# Altium schematic sheet INV.Main.SCH.SchDoc (part 1 of 2)
size 1549 x 599 mm; SheetNumber: 1; SheetTotal: 1
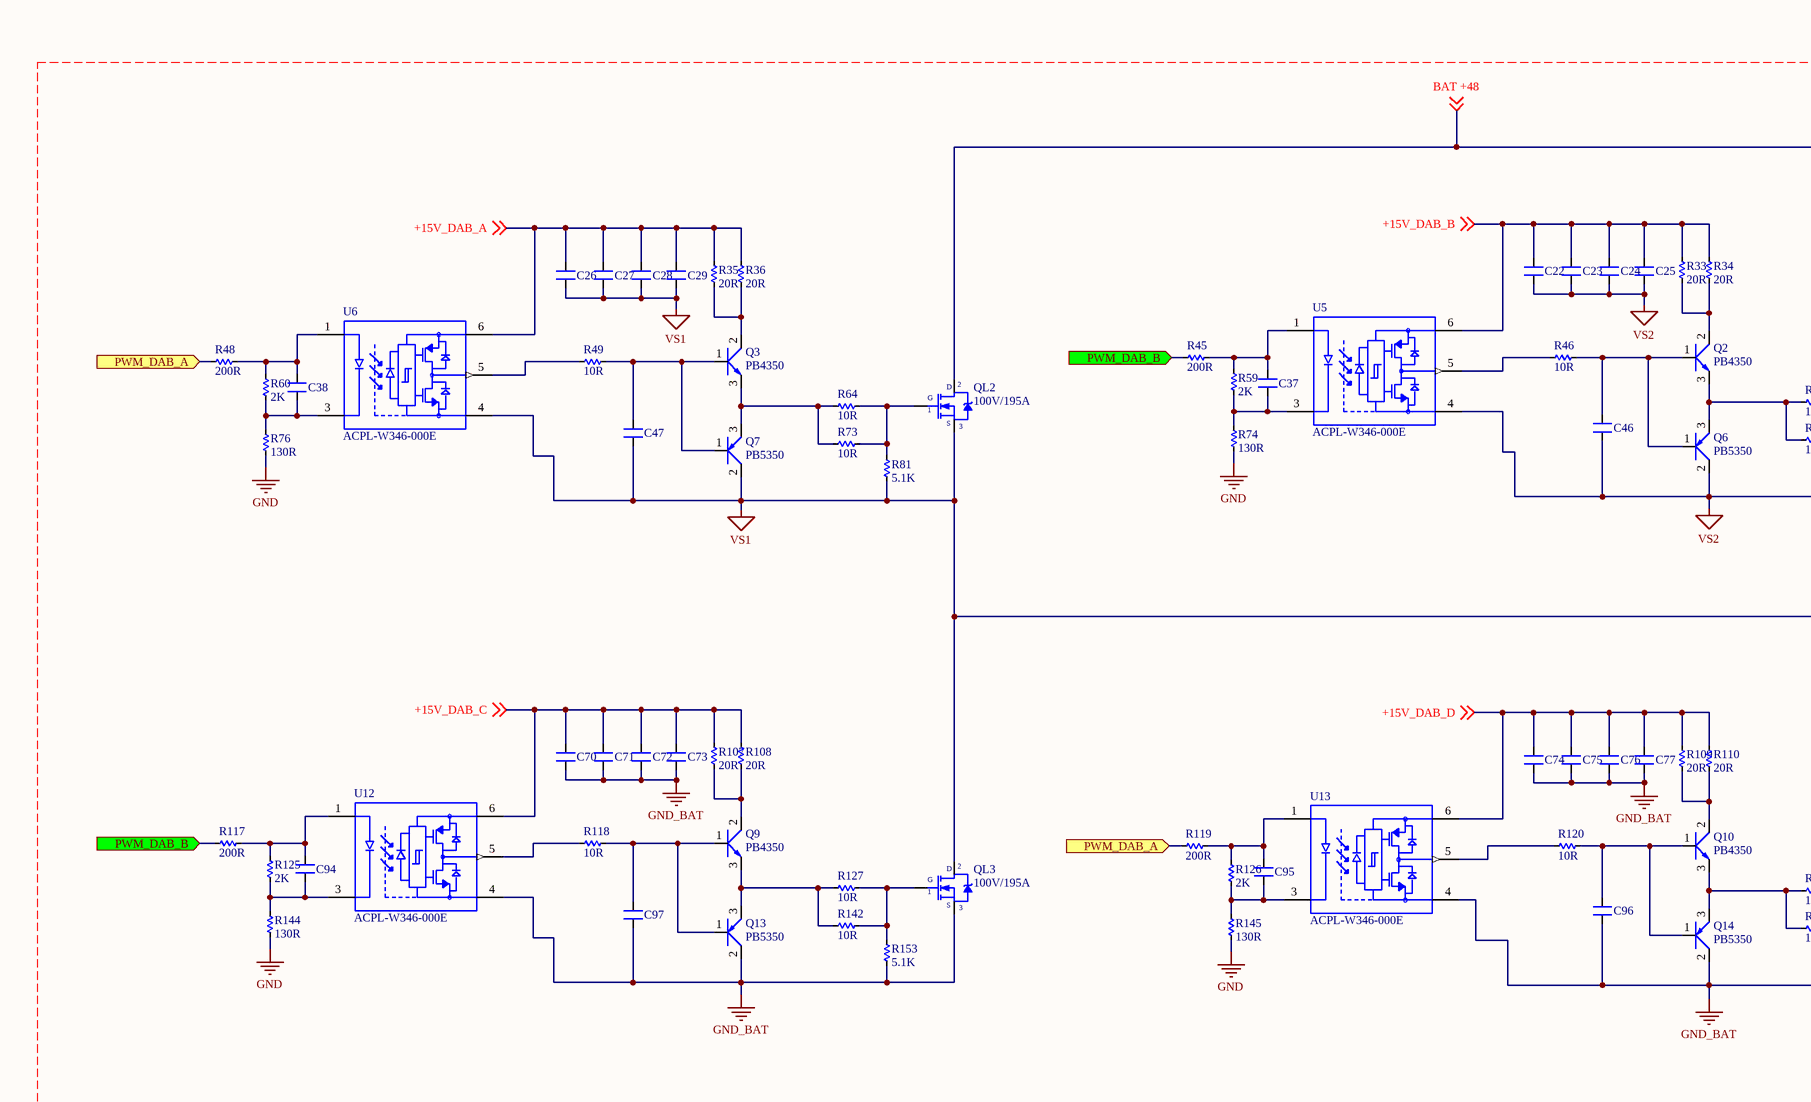
[diagram p0: INV.Main.SCH.SchDoc, top column 1 of 4]
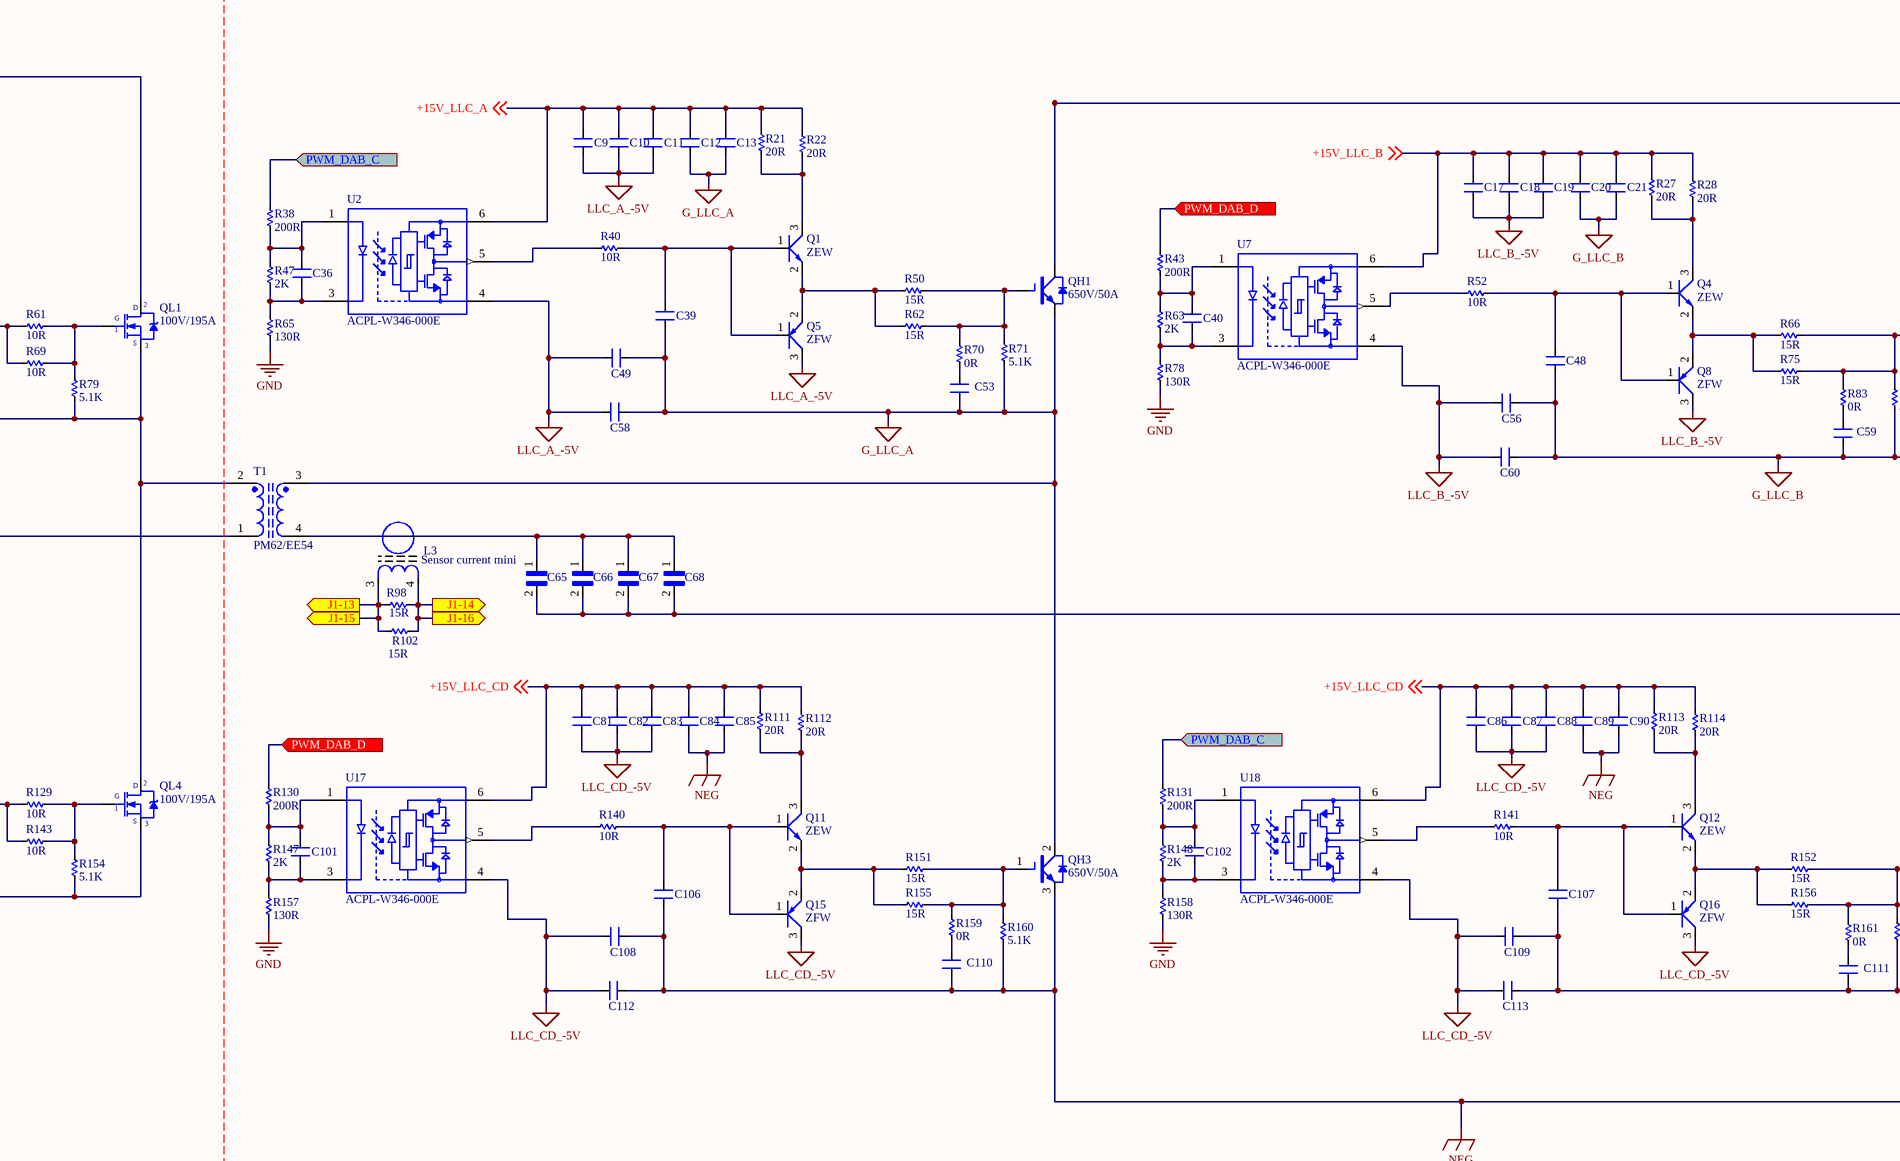
[diagram p1: INV.Main.SCH.SchDoc, top column 2 of 4]
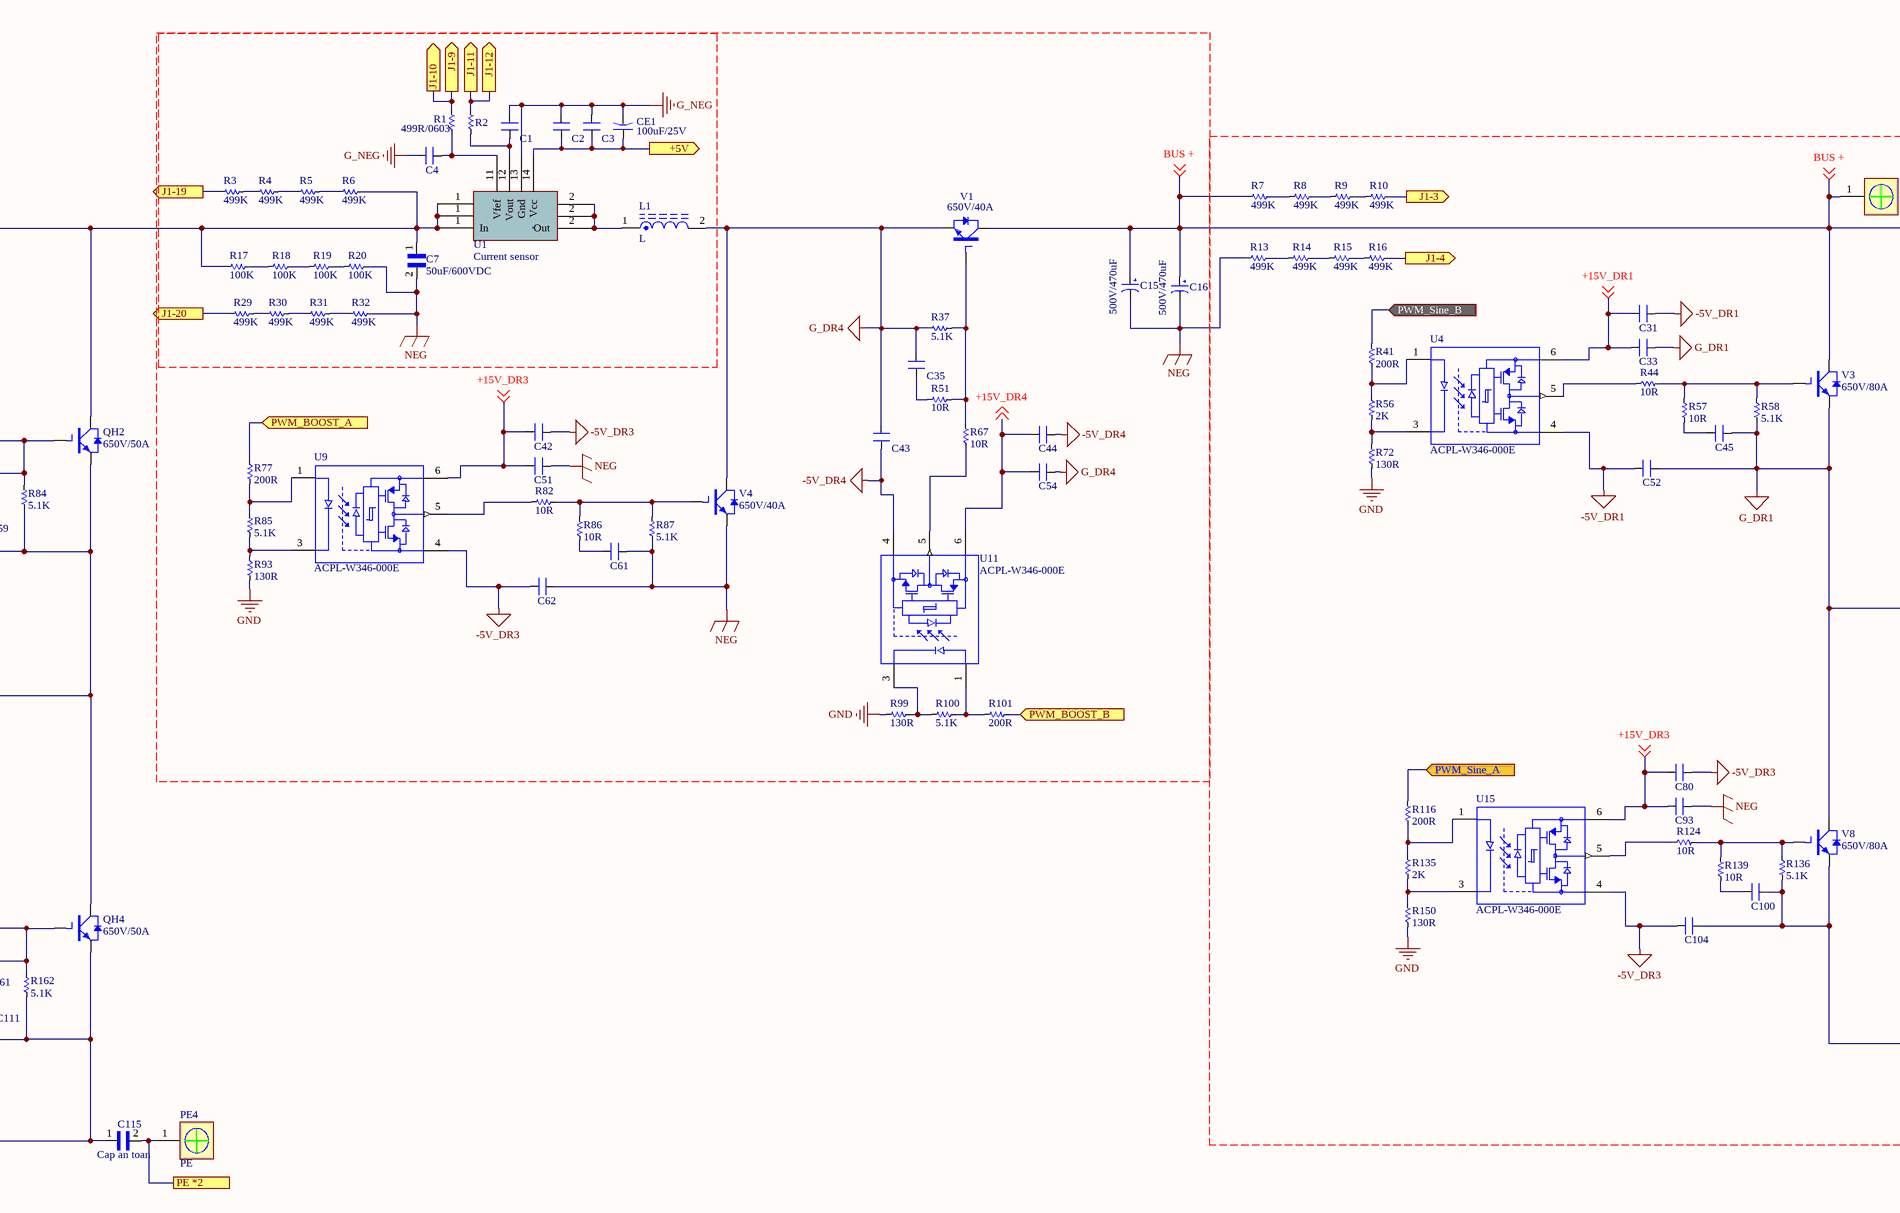
[diagram p2: INV.Main.SCH.SchDoc, top column 3 of 4]
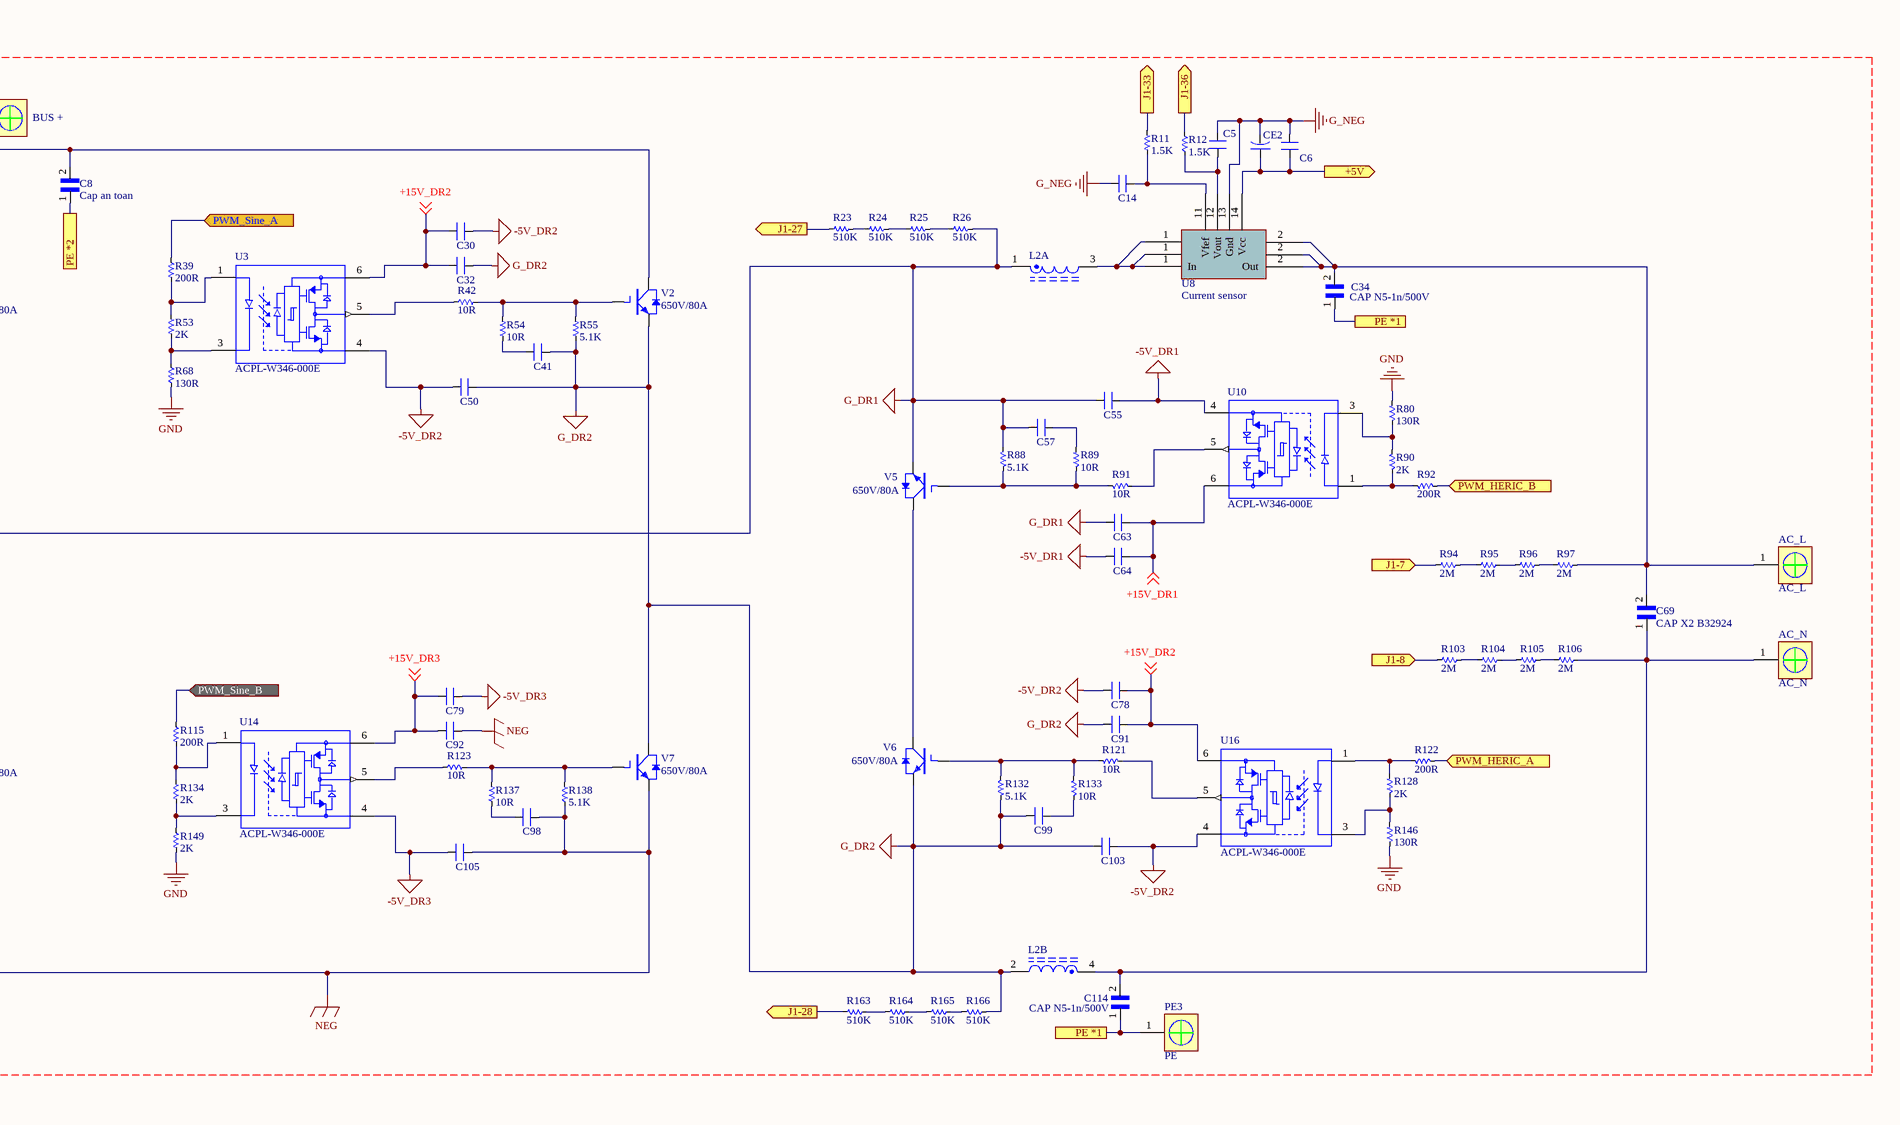
[diagram p3: INV.Main.SCH.SchDoc, top column 4 of 4]
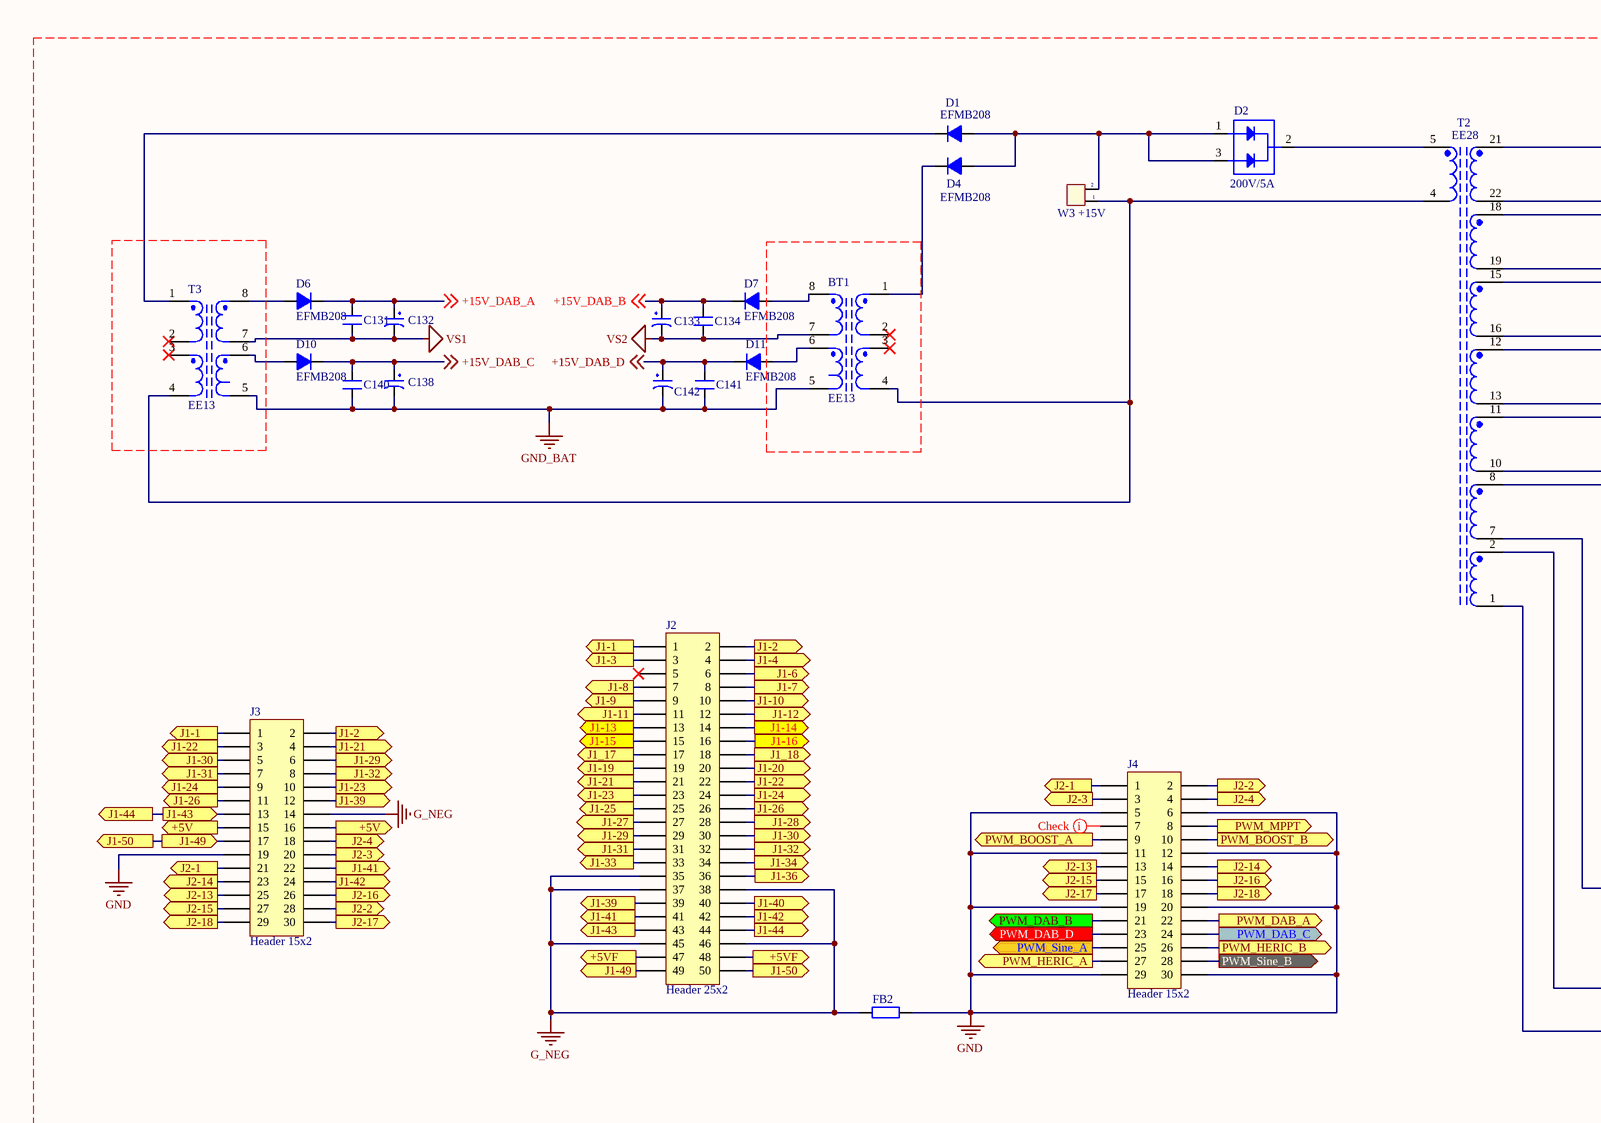
[diagram p4: INV.Main.SCH.SchDoc, bottom column 1 of 4]
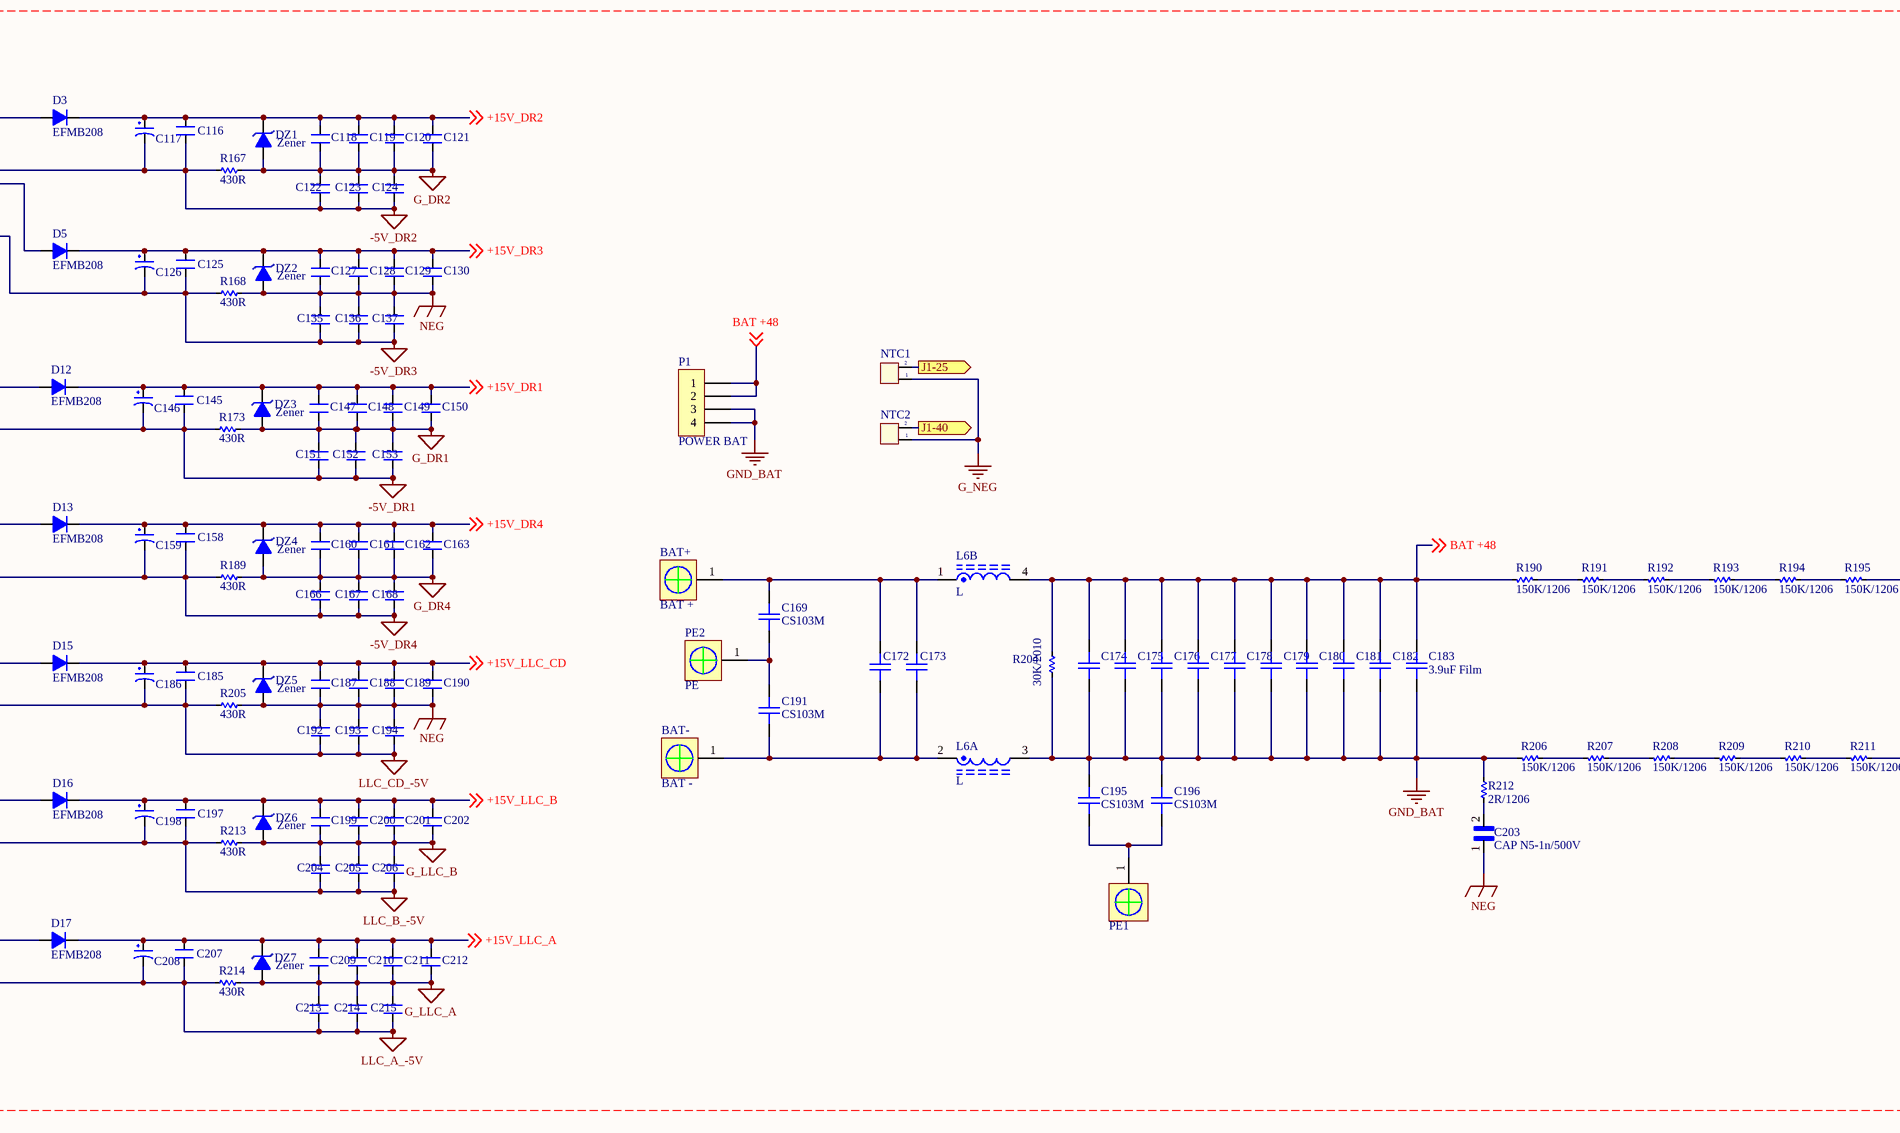
[diagram p5: INV.Main.SCH.SchDoc, bottom column 2 of 4]
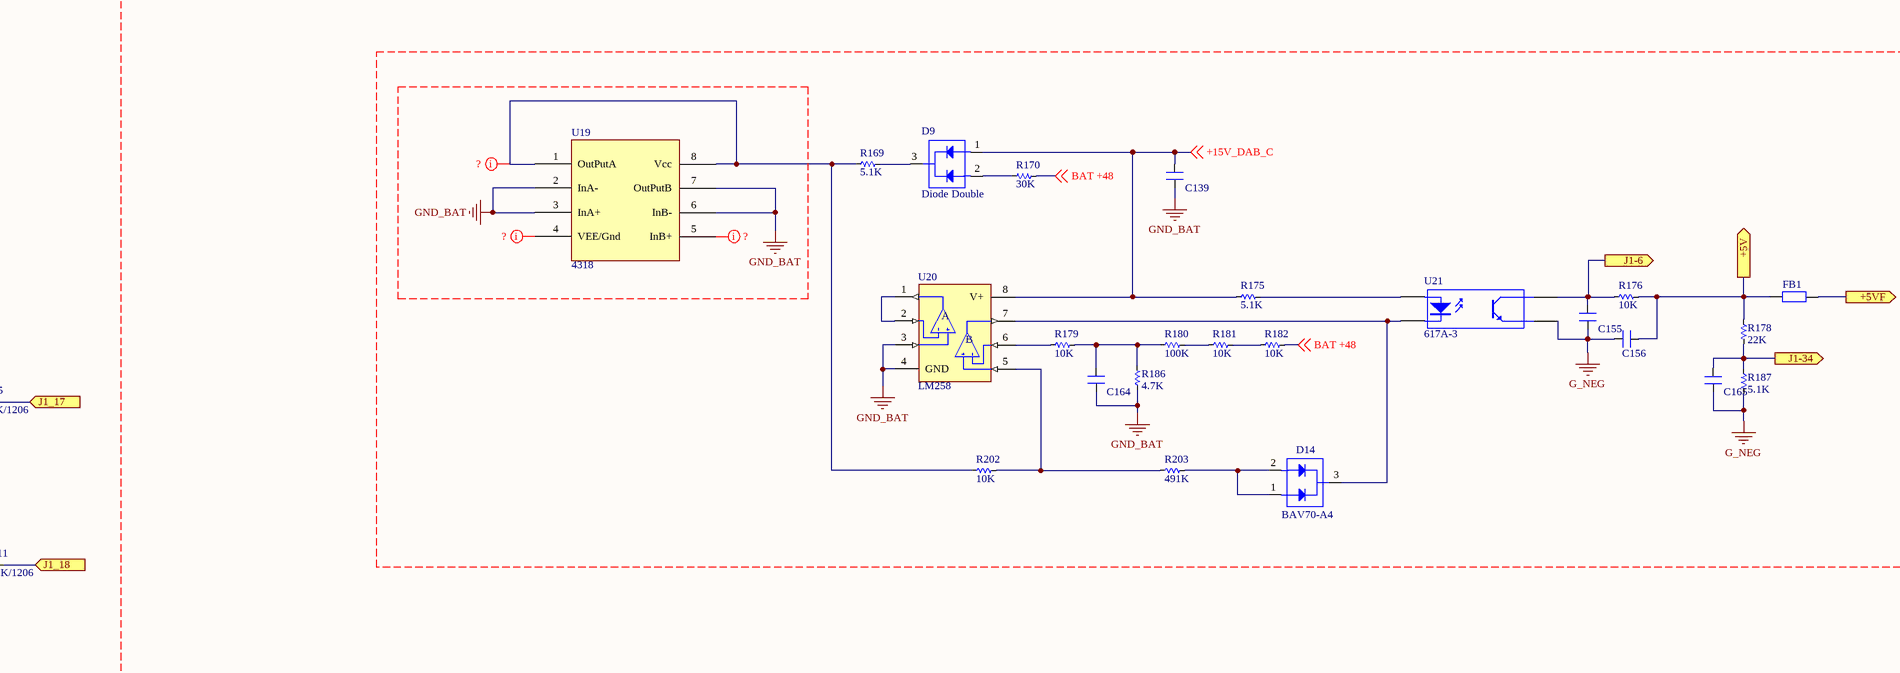
[diagram p6: INV.Main.SCH.SchDoc, bottom column 3 of 4]
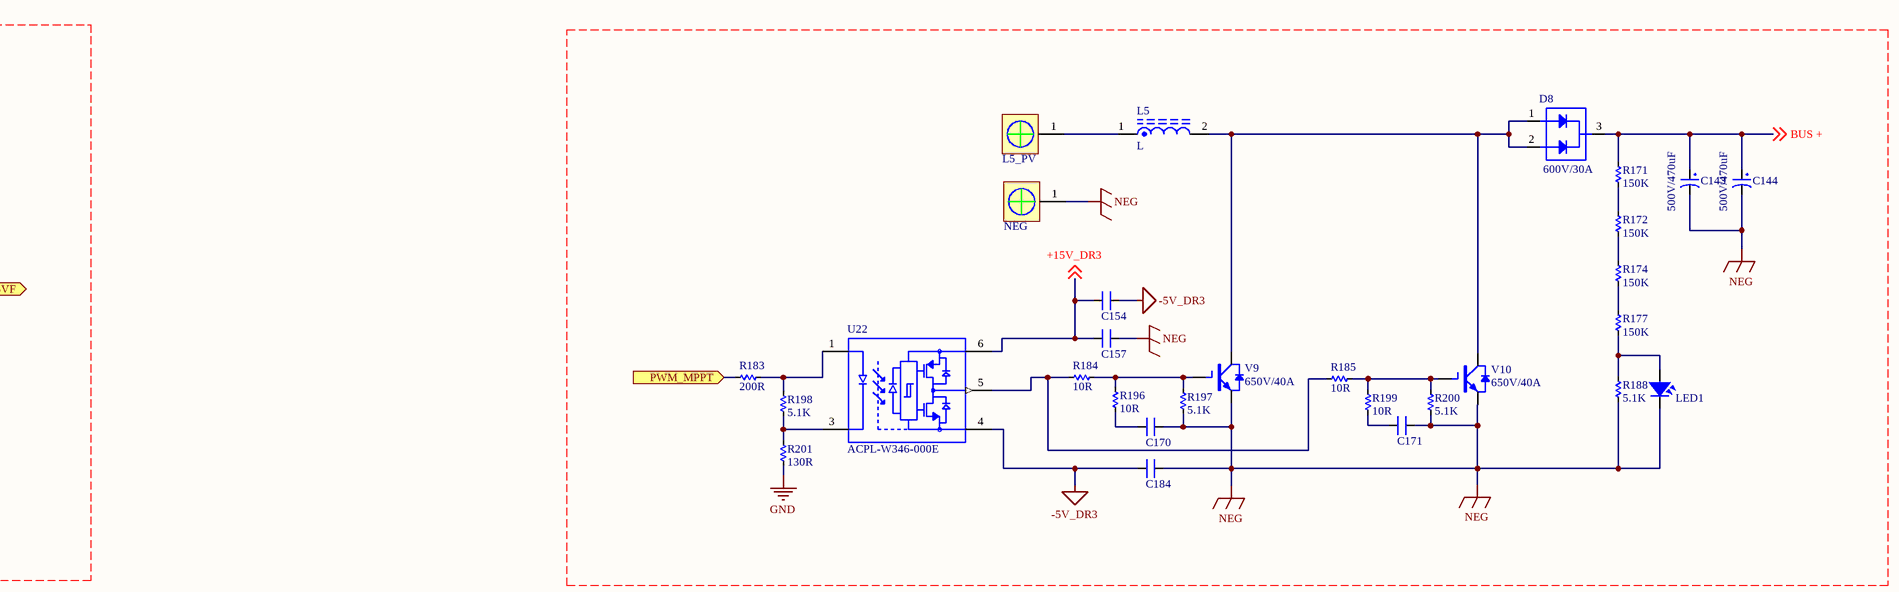
[diagram p7: INV.Main.SCH.SchDoc, bottom column 4 of 4]

## Parts
AC_L  AC_L  [Copper Pipe]
AC_N  AC_N  [Copper Pipe]
BAT+  BAT +  [Copper Pipe]
BAT-  BAT -  [Copper Pipe]
BT1  EE13  [Transformer EE13]
BUS+  BUS +  [Copper Pipe]
C1  0805  [CAP-SMD-0805 EX]  (value not drawn)
C2  0805  [CAP-SMD-0805 EX]  (value not drawn)
C3  0805  [CAP-SMD-0805 EX]  (value not drawn)
C4  0805  [CAP-SMD-0805 EX]  (value not drawn)
C5  0805  [CAP-SMD-0805 EX]  (value not drawn)
C6  0805  [CAP-SMD-0805 EX]  (value not drawn)
C7  50uF/600VDC  [CAP C3D 35x46x35mm]
C8  Cap an toan  [Cap an toan]
C9  0805  [CAP-SMD-0805 EX]  (value not drawn)
C10  0805  [CAP-SMD-0805 EX]  (value not drawn)
C11  0805  [CAP-SMD-0805 EX]  (value not drawn)
C12  0805  [CAP-SMD-0805 EX]  (value not drawn)
C13  0805  [CAP-SMD-0805 EX]  (value not drawn)
C14  0805  [CAP-SMD-0805 EX]  (value not drawn)
C15  500V/470uF  [CAP-35x60mm]
C16  500V/470uF  [CAP-35x60mm]
C17  0805  [CAP-SMD-0805 EX]  (value not drawn)
C18  0805  [CAP-SMD-0805 EX]  (value not drawn)
C19  0805  [CAP-SMD-0805 EX]  (value not drawn)
C20  0805  [CAP-SMD-0805 EX]  (value not drawn)
C21  0805  [CAP-SMD-0805 EX]  (value not drawn)
C22  0805  [CAP-SMD-0805 EX]  (value not drawn)
C23  0805  [CAP-SMD-0805 EX]  (value not drawn)
C24  0805  [CAP-SMD-0805 EX]  (value not drawn)
C25  0805  [CAP-SMD-0805 EX]  (value not drawn)
C26  0805  [CAP-SMD-0805 EX]  (value not drawn)
C27  0805  [CAP-SMD-0805 EX]  (value not drawn)
C28  0805  [CAP-SMD-0805 EX]  (value not drawn)
C29  0805  [CAP-SMD-0805 EX]  (value not drawn)
C30  0805  [CAP-SMD-0805 EX]  (value not drawn)
C31  0805  [CAP-SMD-0805 EX]  (value not drawn)
C32  0805  [CAP-SMD-0805 EX]  (value not drawn)
C33  0805  [CAP-SMD-0805 EX]  (value not drawn)
C34  CAP N5-1n/500V  [CAP 1nF/500VAC, Y1]
C35  0805  [CAP-SMD-0805 EX]  (value not drawn)
C36  0805  [CAP-SMD-0805 EX]  (value not drawn)
C37  0805  [CAP-SMD-0805 EX]  (value not drawn)
C38  0805  [CAP-SMD-0805 EX]  (value not drawn)
C39  0805  [CAP-SMD-0805 EX]  (value not drawn)
C40  0805  [CAP-SMD-0805 EX]  (value not drawn)
C41  0805  [CAP-SMD-0805 EX]  (value not drawn)
C42  0805  [CAP-SMD-0805 EX]  (value not drawn)
C43  0805  [CAP-SMD-0805 EX]  (value not drawn)
C44  0805  [CAP-SMD-0805 EX]  (value not drawn)
C45  0805  [CAP-SMD-0805 EX]  (value not drawn)
C46  0805  [CAP-SMD-0805 EX]  (value not drawn)
C47  0805  [CAP-SMD-0805 EX]  (value not drawn)
C48  0805  [CAP-SMD-0805 EX]  (value not drawn)
C49  0805  [CAP-SMD-0805 EX]  (value not drawn)
C50  0805  [CAP-SMD-0805 EX]  (value not drawn)
C51  0805  [CAP-SMD-0805 EX]  (value not drawn)
C52  0805  [CAP-SMD-0805 EX]  (value not drawn)
C53  Tu dan gom  [CAP-SMD-0805 EX]  (value not drawn)
C54  0805  [CAP-SMD-0805 EX]  (value not drawn)
C55  0805  [CAP-SMD-0805 EX]  (value not drawn)
C56  0805  [CAP-SMD-0805 EX]  (value not drawn)
C57  0805  [CAP-SMD-0805 EX]  (value not drawn)
C58  0805  [CAP-SMD-0805 EX]  (value not drawn)
C59  0805  [CAP-SMD-0805 EX]  (value not drawn)
C60  0805  [CAP-SMD-0805 EX]  (value not drawn)
C61  0805  [CAP-SMD-0805 EX]  (value not drawn)
C62  0805  [CAP-SMD-0805 EX]  (value not drawn)
C63  0805  [CAP-SMD-0805 EX]  (value not drawn)
C64  0805  [CAP-SMD-0805 EX]  (value not drawn)
C65  CBB 150nF/630V  [CAP MMPK82]  (value not drawn)
C66  CBB 150nF/630V  [CAP MMPK82]  (value not drawn)
C67  CBB 150nF/630V  [CAP MMPK82]  (value not drawn)
C68  CBB 150nF/630V  [CAP MMPK82]  (value not drawn)
C69  CAP X2 B32924  [CAP X2 B32924]
C70  0805  [CAP-SMD-0805 EX]  (value not drawn)
C71  0805  [CAP-SMD-0805 EX]  (value not drawn)
C72  0805  [CAP-SMD-0805 EX]  (value not drawn)
C73  0805  [CAP-SMD-0805 EX]  (value not drawn)
C74  0805  [CAP-SMD-0805 EX]  (value not drawn)
C75  0805  [CAP-SMD-0805 EX]  (value not drawn)
C76  0805  [CAP-SMD-0805 EX]  (value not drawn)
C77  0805  [CAP-SMD-0805 EX]  (value not drawn)
C78  0805  [CAP-SMD-0805 EX]  (value not drawn)
C79  0805  [CAP-SMD-0805 EX]  (value not drawn)
C80  0805  [CAP-SMD-0805 EX]  (value not drawn)
C81  0805  [CAP-SMD-0805 EX]  (value not drawn)
C82  0805  [CAP-SMD-0805 EX]  (value not drawn)
C83  0805  [CAP-SMD-0805 EX]  (value not drawn)
C84  0805  [CAP-SMD-0805 EX]  (value not drawn)
C85  0805  [CAP-SMD-0805 EX]  (value not drawn)
C86  0805  [CAP-SMD-0805 EX]  (value not drawn)
C87  0805  [CAP-SMD-0805 EX]  (value not drawn)
C88  0805  [CAP-SMD-0805 EX]  (value not drawn)
C89  0805  [CAP-SMD-0805 EX]  (value not drawn)
C90  0805  [CAP-SMD-0805 EX]  (value not drawn)
C91  0805  [CAP-SMD-0805 EX]  (value not drawn)
C92  0805  [CAP-SMD-0805 EX]  (value not drawn)
C93  0805  [CAP-SMD-0805 EX]  (value not drawn)
C94  0805  [CAP-SMD-0805 EX]  (value not drawn)
C95  0805  [CAP-SMD-0805 EX]  (value not drawn)
C96  0805  [CAP-SMD-0805 EX]  (value not drawn)
C97  0805  [CAP-SMD-0805 EX]  (value not drawn)
C98  0805  [CAP-SMD-0805 EX]  (value not drawn)
C99  0805  [CAP-SMD-0805 EX]  (value not drawn)
C100  0805  [CAP-SMD-0805 EX]  (value not drawn)
C101  0805  [CAP-SMD-0805 EX]  (value not drawn)
C102  0805  [CAP-SMD-0805 EX]  (value not drawn)
C103  0805  [CAP-SMD-0805 EX]  (value not drawn)
C104  0805  [CAP-SMD-0805 EX]  (value not drawn)
C105  0805  [CAP-SMD-0805 EX]  (value not drawn)
C106  0805  [CAP-SMD-0805 EX]  (value not drawn)
C107  0805  [CAP-SMD-0805 EX]  (value not drawn)
C108  0805  [CAP-SMD-0805 EX]  (value not drawn)
C109  0805  [CAP-SMD-0805 EX]  (value not drawn)
C110  Tu dan gom  [CAP-SMD-0805 EX]  (value not drawn)
C111  Tu dan gom  [CAP-SMD-0805 EX]  (value not drawn)
C112  0805  [CAP-SMD-0805 EX]  (value not drawn)
C113  0805  [CAP-SMD-0805 EX]  (value not drawn)
C114  CAP N5-1n/500V  [CAP 1nF/500VAC, Y1]
C115  Cap an toan  [Cap an toan]
C116  Tu dan gom  [CAP-SMD-0805 EX]  (value not drawn)
C117  100uF/25V  [CA-6-P2.5]  (value not drawn)
C118  Tu dan gom  [CAP-SMD-0805 EX]  (value not drawn)
C119  Tu dan gom  [CAP-SMD-0805 EX]  (value not drawn)
C120  Tu dan gom  [CAP-SMD-0805 EX]  (value not drawn)
C121  Tu dan gom  [CAP-SMD-0805 EX]  (value not drawn)
C122  Tu dan gom  [CAP-SMD-0805 EX]  (value not drawn)
C123  Tu dan gom  [CAP-SMD-0805 EX]  (value not drawn)
C124  Tu dan gom  [CAP-SMD-0805 EX]  (value not drawn)
C125  Tu dan gom  [CAP-SMD-0805 EX]  (value not drawn)
C126  100uF/25V  [CA-6-P2.5]  (value not drawn)
C127  Tu dan gom  [CAP-SMD-0805 EX]  (value not drawn)
C128  Tu dan gom  [CAP-SMD-0805 EX]  (value not drawn)
C129  Tu dan gom  [CAP-SMD-0805 EX]  (value not drawn)
C130  Tu dan gom  [CAP-SMD-0805 EX]  (value not drawn)
C131  0805  [CAP-SMD-0805 EX]  (value not drawn)
C132  100uF/25V  [CA-6-P2.5]  (value not drawn)
C133  100uF/25V  [CA-6-P2.5]  (value not drawn)
C134  0805  [CAP-SMD-0805 EX]  (value not drawn)
C135  Tu dan gom  [CAP-SMD-0805 EX]  (value not drawn)
C136  Tu dan gom  [CAP-SMD-0805 EX]  (value not drawn)
C137  Tu dan gom  [CAP-SMD-0805 EX]  (value not drawn)
C138  100uF/25V  [CA-6-P2.5]  (value not drawn)
C139  0805  [CAP-SMD-0805 EX]  (value not drawn)
C140  0805  [CAP-SMD-0805 EX]  (value not drawn)
C141  0805  [CAP-SMD-0805 EX]  (value not drawn)
C142  100uF/25V  [CA-6-P2.5]  (value not drawn)
C143  500V/470uF  [CAP-35x60mm]
C144  500V/470uF  [CAP-35x60mm]
C145  Tu dan gom  [CAP-SMD-0805 EX]  (value not drawn)
C146  100uF/25V  [CA-6-P2.5]  (value not drawn)
C147  Tu dan gom  [CAP-SMD-0805 EX]  (value not drawn)
C148  Tu dan gom  [CAP-SMD-0805 EX]  (value not drawn)
C149  Tu dan gom  [CAP-SMD-0805 EX]  (value not drawn)
C150  Tu dan gom  [CAP-SMD-0805 EX]  (value not drawn)
C151  Tu dan gom  [CAP-SMD-0805 EX]  (value not drawn)
C152  Tu dan gom  [CAP-SMD-0805 EX]  (value not drawn)
C153  Tu dan gom  [CAP-SMD-0805 EX]  (value not drawn)
C154  0805  [CAP-SMD-0805 EX]  (value not drawn)
C155  0805  [CAP-SMD-0805 EX]  (value not drawn)
C156  0805  [CAP-SMD-0805 EX]  (value not drawn)
C157  0805  [CAP-SMD-0805 EX]  (value not drawn)
C158  Tu dan gom  [CAP-SMD-0805 EX]  (value not drawn)
C159  100uF/25V  [CA-6-P2.5]  (value not drawn)
C160  Tu dan gom  [CAP-SMD-0805 EX]  (value not drawn)
C161  Tu dan gom  [CAP-SMD-0805 EX]  (value not drawn)
C162  Tu dan gom  [CAP-SMD-0805 EX]  (value not drawn)
C163  Tu dan gom  [CAP-SMD-0805 EX]  (value not drawn)
C164  0805  [CAP-SMD-0805 EX]  (value not drawn)
C165  0805  [CAP-SMD-0805 EX]  (value not drawn)
C166  Tu dan gom  [CAP-SMD-0805 EX]  (value not drawn)
C167  Tu dan gom  [CAP-SMD-0805 EX]  (value not drawn)
C168  Tu dan gom  [CAP-SMD-0805 EX]  (value not drawn)
C169  CS103M  [Cap an toan CS103M]
C170  0805  [CAP-SMD-0805 EX]  (value not drawn)
C171  0805  [CAP-SMD-0805 EX]  (value not drawn)
C172  (no value)  [CAP-SMD-1206 EX]
C173  (no value)  [CAP-SMD-1206 EX]
C174  3.9uF Film  [Cap Film CL21]  (value not drawn)
C175  395K  [Cap Film CL21]  (value not drawn)
C176  395K  [Cap Film CL21]  (value not drawn)
C177  395K  [Cap Film CL21]  (value not drawn)
C178  395K  [Cap Film CL21]  (value not drawn)
C179  395K  [Cap Film CL21]  (value not drawn)
C180  395K  [Cap Film CL21]  (value not drawn)
C181  395K  [Cap Film CL21]  (value not drawn)
C182  395K  [Cap Film CL21]  (value not drawn)
C183  3.9uF Film  [Cap Film CL21]
C184  0805  [CAP-SMD-0805 EX]  (value not drawn)
C185  Tu dan gom  [CAP-SMD-0805 EX]  (value not drawn)
C186  100uF/25V  [CA-6-P2.5]  (value not drawn)
C187  Tu dan gom  [CAP-SMD-0805 EX]  (value not drawn)
C188  Tu dan gom  [CAP-SMD-0805 EX]  (value not drawn)
C189  Tu dan gom  [CAP-SMD-0805 EX]  (value not drawn)
C190  Tu dan gom  [CAP-SMD-0805 EX]  (value not drawn)
C191  CS103M  [Cap an toan CS103M]
C192  Tu dan gom  [CAP-SMD-0805 EX]  (value not drawn)
C193  Tu dan gom  [CAP-SMD-0805 EX]  (value not drawn)
C194  Tu dan gom  [CAP-SMD-0805 EX]  (value not drawn)
C195  CS103M  [Cap an toan CS103M]
C196  CS103M  [Cap an toan CS103M]
C197  Tu dan gom  [CAP-SMD-0805 EX]  (value not drawn)
C198  100uF/25V  [CA-6-P2.5]  (value not drawn)
C199  Tu dan gom  [CAP-SMD-0805 EX]  (value not drawn)
C200  Tu dan gom  [CAP-SMD-0805 EX]  (value not drawn)
C201  Tu dan gom  [CAP-SMD-0805 EX]  (value not drawn)
C202  Tu dan gom  [CAP-SMD-0805 EX]  (value not drawn)
C203  CAP N5-1n/500V  [CAP 1nF/500VAC, Y1]
C204  Tu dan gom  [CAP-SMD-0805 EX]  (value not drawn)
C205  Tu dan gom  [CAP-SMD-0805 EX]  (value not drawn)
C206  Tu dan gom  [CAP-SMD-0805 EX]  (value not drawn)
C207  Tu dan gom  [CAP-SMD-0805 EX]  (value not drawn)
C208  100uF/25V  [CA-6-P2.5]  (value not drawn)
C209  Tu dan gom  [CAP-SMD-0805 EX]  (value not drawn)
C210  Tu dan gom  [CAP-SMD-0805 EX]  (value not drawn)
C211  Tu dan gom  [CAP-SMD-0805 EX]  (value not drawn)
C212  Tu dan gom  [CAP-SMD-0805 EX]  (value not drawn)
C213  Tu dan gom  [CAP-SMD-0805 EX]  (value not drawn)
C214  Tu dan gom  [CAP-SMD-0805 EX]  (value not drawn)
C215  Tu dan gom  [CAP-SMD-0805 EX]  (value not drawn)
CE1  100uF/25V  [CA-6-P2.5]
CE2  100uF/25V  [CA-6-P2.5]  (value not drawn)
D1  EFMB208  [SMB]
D2  200V/5A  [TO252-123]
D3  EFMB208  [SMB]
D4  EFMB208  [SMB]
D5  EFMB208  [SMB]
D6  EFMB208  [SMB]
D7  EFMB208  [SMB]
D8  600V/30A  [TO-247-Diode]
D9  Diode Double  [SOT-23]
D10  EFMB208  [SMB]
D11  EFMB208  [SMB]
D12  EFMB208  [SMB]
D13  EFMB208  [SMB]
D14  BAV70-A4  [SOT-23]
D15  EFMB208  [SMB]
D16  EFMB208  [SMB]
D17  EFMB208  [SMB]
DZ1  Zener  [SMA]
DZ2  Zener  [SMA]
DZ3  Zener  [SMA]
DZ4  Zener  [SMA]
DZ5  Zener  [SMA]
DZ6  Zener  [SMA]
DZ7  Zener  [SMA]
FB1  (no value)  [RES-SMD-1206 EX]
FB2  (no value)  [RES-SMD-1206 EX]
J1  W3 +15V  [Header2]
J2  Header 25x2  [Header 2x50]
J3  Header 15x2  [Header 2x15]
J4  Header 15x2  [Header 2x15]
L1  L  [LBOSHOG-V1]
L2  (no value)  [LSINEOG-V1]  (parts A,B of 2)
L3  Sensor current mini  [Current sensor Mini]
L5  L  [LBOSPVOG-V1]
L5_PV  L5_PV  [Copper Pipe]
L6  L  [LBATOG-V1]  (parts A,B of 2)
LED1  LED  [LED-0805-Red]  (value not drawn)
NEG  NEG  [Copper Pipe]
NTC1  Temp Sensor  [JP 1x2 CT]  (value not drawn)
NTC2  Temp Sensor  [JP 1x2 CT]  (value not drawn)
P1  POWER BAT  [XH2.54M-4]
PE1  PE  [Copper Pipe]  (value not drawn)
PE2  PE  [Copper Pipe]
PE3  PE  [Copper Pipe]
PE4  PE  [Copper Pipe]
Q1  ZEW  [SOT-23]
Q2  PB4350  [SOT-2230P700X175-4N]
Q3  PB4350  [SOT-2230P700X175-4N]
Q4  ZEW  [SOT-23]
Q5  ZFW  [SOT-23]
Q6  PB5350  [SOT-2230P700X175-4N]
Q7  PB5350  [SOT-2230P700X175-4N]
Q8  ZFW  [SOT-23]
Q9  PB4350  [SOT-2230P700X175-4N]
Q10  PB4350  [SOT-2230P700X175-4N]
Q11  ZEW  [SOT-23]
Q12  ZEW  [SOT-23]
Q13  PB5350  [SOT-2230P700X175-4N]
Q14  PB5350  [SOT-2230P700X175-4N]
Q15  ZFW  [SOT-23]
Q16  ZFW  [SOT-23]
QH1  650V/50A  [TO-247_1]
QH2  650V/50A  [TO-247_1]
QH3  650V/50A  [TO-247_1]
QH4  650V/50A  [TO-247_1]
QL1  100V/195A  [TO-247]
QL2  100V/195A  [TO-247]
QL3  100V/195A  [TO-247]
QL4  100V/195A  [TO-247]
R1  499R/0603  [RES-SMD-1206 EX]
R2  499R/0603  [RES-SMD-1206 EX]  (value not drawn)
R3  499K  [RES-SMD-1206 EX]
R4  499K  [RES-SMD-1206 EX]
R5  499K  [RES-SMD-1206 EX]
R6  499K  [RES-SMD-1206 EX]
R7  499K  [RES-SMD-1206 EX]
R8  499K  [RES-SMD-1206 EX]
R9  499K  [RES-SMD-1206 EX]
R10  499K  [RES-SMD-1206 EX]
R11  1.5K  [RES-SMD-0805 EX]
R12  1.5K  [RES-SMD-0805 EX]
R13  499K  [RES-SMD-1206 EX]
R14  499K  [RES-SMD-1206 EX]
R15  499K  [RES-SMD-1206 EX]
R16  499K  [RES-SMD-1206 EX]
R17  100K  [RES-SMD-1206 EX]
R18  100K  [RES-SMD-1206 EX]
R19  100K  [RES-SMD-1206 EX]
R20  100K  [RES-SMD-1206 EX]
R21  20R  [RES-SMD-1206 EX]
R22  20R  [RES-SMD-1206 EX]
R23  510K  [RES-SMD-1206 EX]
R24  510K  [RES-SMD-1206 EX]
R25  510K  [RES-SMD-1206 EX]
R26  510K  [RES-SMD-1206 EX]
R27  20R  [RES-SMD-1206 EX]
R28  20R  [RES-SMD-1206 EX]
R29  499K  [RES-SMD-1206 EX]
R30  499K  [RES-SMD-1206 EX]
R31  499K  [RES-SMD-1206 EX]
R32  499K  [RES-SMD-1206 EX]
R33  20R  [RES-SMD-1206 EX]
R34  20R  [RES-SMD-1206 EX]
R35  20R  [RES-SMD-1206 EX]
R36  20R  [RES-SMD-1206 EX]
R37  5.1K  [RES-SMD-0805 EX]
R38  200R  [RES-SMD-0805 EX]
R39  200R  [RES-SMD-0805 EX]
R40  10R  [RES-SMD-1206 EX]
R41  200R  [RES-SMD-0805 EX]
R42  10R  [RES-SMD-1206 EX]
R43  200R  [RES-SMD-0805 EX]
R44  10R  [RES-SMD-1206 EX]
R45  200R  [RES-SMD-0805 EX]
R46  10R  [RES-SMD-1206 EX]
R47  2K  [RES-SMD-0805 EX]
R48  200R  [RES-SMD-0805 EX]
R49  10R  [RES-SMD-1206 EX]
R50  15R  [RES-SMD-1206 EX]
R51  10R  [RES-SMD-0805 EX]
R52  10R  [RES-SMD-1206 EX]
R53  2K  [RES-SMD-0805 EX]
R54  10R  [RES-SMD-0805 EX]
R55  5.1K  [RES-SMD-0805 EX]
R56  2K  [RES-SMD-0805 EX]
R57  10R  [RES-SMD-0805 EX]
R58  5.1K  [RES-SMD-0805 EX]
R59  2K  [RES-SMD-0805 EX]
R60  2K  [RES-SMD-0805 EX]
R61  10R  [RES-SMD-1206 EX]
R62  15R  [RES-SMD-1206 EX]
R63  2K  [RES-SMD-0805 EX]
R64  10R  [RES-SMD-1206 EX]
R65  130R  [RES-SMD-0805 EX]
R66  15R  [RES-SMD-1206 EX]
R67  10R  [RES-SMD-1206 EX]
R68  130R  [RES-SMD-0805 EX]
R69  10R  [RES-SMD-1206 EX]
R70  0R  [RES-SMD-0805 EX]
R71  5.1K  [RES-SMD-0805 EX]
R72  130R  [RES-SMD-0805 EX]
R73  10R  [RES-SMD-1206 EX]
R74  130R  [RES-SMD-0805 EX]
R75  15R  [RES-SMD-1206 EX]
R76  130R  [RES-SMD-0805 EX]
R77  200R  [RES-SMD-0805 EX]
R78  130R  [RES-SMD-0805 EX]
R79  5.1K  [RES-SMD-0805 EX]
R80  130R  [RES-SMD-0805 EX]
R81  5.1K  [RES-SMD-0805 EX]
R82  10R  [RES-SMD-1206 EX]
R83  0R  [RES-SMD-0805 EX]
R84  5.1K  [RES-SMD-0805 EX]
R85  5.1K  [RES-SMD-0805 EX]
R86  10R  [RES-SMD-0805 EX]
R87  5.1K  [RES-SMD-0805 EX]
R88  5.1K  [RES-SMD-0805 EX]
R89  10R  [RES-SMD-0805 EX]
R90  2K  [RES-SMD-0805 EX]
R91  10R  [RES-SMD-1206 EX]
R92  200R  [RES-SMD-0805 EX]
R93  130R  [RES-SMD-0805 EX]
R94  2M  [RES-SMD-1206 EX]
R95  2M  [RES-SMD-1206 EX]
R96  2M  [RES-SMD-1206 EX]
R97  2M  [RES-SMD-1206 EX]
R98  15R  [RES-SMD-1206 EX]
R99  130R  [RES-SMD-0805 EX]
R100  5.1K  [RES-SMD-0805 EX]
R101  200R  [RES-SMD-0805 EX]
R102  15R  [RES-SMD-1206 EX]
R103  2M  [RES-SMD-1206 EX]
R104  2M  [RES-SMD-1206 EX]
R105  2M  [RES-SMD-1206 EX]
R106  2M  [RES-SMD-1206 EX]
R107  20R  [RES-SMD-1206 EX]
R108  20R  [RES-SMD-1206 EX]
R109  20R  [RES-SMD-1206 EX]
R110  20R  [RES-SMD-1206 EX]
R111  20R  [RES-SMD-1206 EX]
R112  20R  [RES-SMD-1206 EX]
R113  20R  [RES-SMD-1206 EX]
R114  20R  [RES-SMD-1206 EX]
R115  200R  [RES-SMD-0805 EX]
R116  200R  [RES-SMD-0805 EX]
R117  200R  [RES-SMD-0805 EX]
R118  10R  [RES-SMD-1206 EX]
R119  200R  [RES-SMD-0805 EX]
R120  10R  [RES-SMD-1206 EX]
R121  10R  [RES-SMD-1206 EX]
R122  200R  [RES-SMD-0805 EX]
R123  10R  [RES-SMD-1206 EX]
R124  10R  [RES-SMD-1206 EX]
R125  2K  [RES-SMD-0805 EX]
R126  2K  [RES-SMD-0805 EX]
R127  10R  [RES-SMD-1206 EX]
R128  2K  [RES-SMD-0805 EX]
R129  10R  [RES-SMD-1206 EX]
R130  200R  [RES-SMD-0805 EX]
R131  200R  [RES-SMD-0805 EX]
R132  5.1K  [RES-SMD-0805 EX]
R133  10R  [RES-SMD-0805 EX]
R134  2K  [RES-SMD-0805 EX]
R135  2K  [RES-SMD-0805 EX]
R136  5.1K  [RES-SMD-0805 EX]
R137  10R  [RES-SMD-0805 EX]
R138  5.1K  [RES-SMD-0805 EX]
R139  10R  [RES-SMD-0805 EX]
R140  10R  [RES-SMD-1206 EX]
R141  10R  [RES-SMD-1206 EX]
R142  10R  [RES-SMD-1206 EX]
R143  10R  [RES-SMD-1206 EX]
R144  130R  [RES-SMD-0805 EX]
R145  130R  [RES-SMD-0805 EX]
R146  130R  [RES-SMD-0805 EX]
R147  2K  [RES-SMD-0805 EX]
R148  2K  [RES-SMD-0805 EX]
R149  2K  [RES-SMD-0805 EX]
R150  130R  [RES-SMD-0805 EX]
R151  15R  [RES-SMD-1206 EX]
R152  15R  [RES-SMD-1206 EX]
R153  5.1K  [RES-SMD-0805 EX]
R154  5.1K  [RES-SMD-0805 EX]
R155  15R  [RES-SMD-1206 EX]
R156  15R  [RES-SMD-1206 EX]
R157  130R  [RES-SMD-0805 EX]
R158  130R  [RES-SMD-0805 EX]
R159  0R  [RES-SMD-0805 EX]
R160  5.1K  [RES-SMD-0805 EX]
R161  0R  [RES-SMD-0805 EX]
R162  5.1K  [RES-SMD-0805 EX]
R163  510K  [RES-SMD-1206 EX]
R164  510K  [RES-SMD-1206 EX]
R165  510K  [RES-SMD-1206 EX]
R166  510K  [RES-SMD-1206 EX]
R167  430R  [RES-SMD-1210 EX]
R168  430R  [RES-SMD-1210 EX]
R169  5.1K  [RES-SMD-0805 EX]
R170  30K  [RES-SMD-1210 EX]
R171  150K  [RES-SMD-1210 EX]
R172  150K  [RES-SMD-1210 EX]
R173  430R  [RES-SMD-1210 EX]
R174  150K  [RES-SMD-1210 EX]
R175  5.1K  [RES-SMD-0805 EX]
R176  10K  [RES-SMD-0805 EX]
R177  150K  [RES-SMD-1210 EX]
R178  22K  [RES-SMD-0805 EX]
R179  10K  [RES-SMD-0805 EX]
R180  100K  [RES-SMD-1206 EX]
R181  10K  [RES-SMD-0805 EX]
R182  10K  [RES-SMD-0805 EX]
R183  200R  [RES-SMD-0805 EX]
R184  10R  [RES-SMD-1206 EX]
R185  10R  [RES-SMD-1206 EX]
R186  4.7K  [RES-SMD-0805 EX]
R187  5.1K  [RES-SMD-0805 EX]
R188  5.1K  [RES-SMD-0805]
R189  430R  [RES-SMD-1210 EX]
R190  150K/1206  [RES-SMD-1206 EX]
R191  150K/1206  [RES-SMD-1206 EX]
R192  150K/1206  [RES-SMD-1206 EX]
R193  150K/1206  [RES-SMD-1206 EX]
R194  150K/1206  [RES-SMD-1206 EX]
R195  150K/1206  [RES-SMD-1206 EX]
R196  10R  [RES-SMD-0805 EX]
R197  5.1K  [RES-SMD-0805 EX]
R198  5.1K  [RES-SMD-0805 EX]
R199  10R  [RES-SMD-0805 EX]
R200  5.1K  [RES-SMD-0805 EX]
R201  130R  [RES-SMD-0805 EX]
R202  10K  [RES-SMD-0805 EX]
R203  491K  [RES-SMD-0805 EX]
R204  30K/2010  [RES-SMD-1210 EX]
R205  430R  [RES-SMD-1210 EX]
R206  150K/1206  [RES-SMD-1206 EX]
R207  150K/1206  [RES-SMD-1206 EX]
R208  150K/1206  [RES-SMD-1206 EX]
R209  150K/1206  [RES-SMD-1206 EX]
R210  150K/1206  [RES-SMD-1206 EX]
R211  150K/1206  [RES-SMD-1206 EX]
R212  2R/1206  [RES-SMD-1206 EX]
R213  430R  [RES-SMD-1210 EX]
R214  430R  [RES-SMD-1210 EX]
T1  PM62/EE54  [Transformer PM62]
T2  EE28  [Transformer EE28]
T3  EE13  [Transformer EE13]
U1  Current sensor  [Current sensor STB-CAS]
U2  ACPL-W346-000E  [SOIC127P1150X360-6N]
U3  ACPL-W346-000E  [SOIC127P1150X360-6N]
U4  ACPL-W346-000E  [SOIC127P1150X360-6N]
U5  ACPL-W346-000E  [SOIC127P1150X360-6N]
U6  ACPL-W346-000E  [SOIC127P1150X360-6N]
U7  ACPL-W346-000E  [SOIC127P1150X360-6N]
U8  Current sensor  [Current sensor STB-CAS]
U9  ACPL-W346-000E  [SOIC127P1150X360-6N]
U10  ACPL-W346-000E  [SOIC127P1150X360-6N]
U11  ACPL-W346-000E  [SOIC127P1150X360-6N]
U12  ACPL-W346-000E  [SOIC127P1150X360-6N]
U13  ACPL-W346-000E  [SOIC127P1150X360-6N]
U14  ACPL-W346-000E  [SOIC127P1150X360-6N]
U15  ACPL-W346-000E  [SOIC127P1150X360-6N]
U16  ACPL-W346-000E  [SOIC127P1150X360-6N]
U17  ACPL-W346-000E  [SOIC127P1150X360-6N]
U18  ACPL-W346-000E  [SOIC127P1150X360-6N]
U19  4318  [SOP 8]
U20  LM258  [SOIC127P600X175-8N]
U21  617A-3  [SOP4]
U22  ACPL-W346-000E  [SOIC127P1150X360-6N]
V1  650V/40A  [TO-247_1]
V2  650V/80A  [TO-247_1]
V3  650V/80A  [TO-247_1]
V4  650V/40A  [TO-247_1]
V5  650V/80A  [TO-247_1]
V6  650V/80A  [TO-247_1]
V7  650V/80A  [TO-247_1]
V8  650V/80A  [TO-247_1]
V9  650V/40A  [TO-247_1]
V10  650V/40A  [TO-247_1]

## Ports
+5V (out, see INV.Main.SCH[1D], INV.Main.SCH[3A], INV.Main.SCH[3D]), +5V (out, see INV.Main.SCH[1D], INV.Main.SCH[3A], INV.Main.SCH[3D], INV.Main.SCH[4A]), +5V (out, see INV.Main.SCH[1D], INV.Main.SCH[3A], INV.Main.SCH[4A]), +5V (out, see INV.Main.SCH[1D], INV.Main.SCH[3D], INV.Main.SCH[4A]), +5VF (out, see INV.Main.SCH[1D]), +5VF (out, see INV.Main.SCH[1D], INV.Main.SCH[3D]), J1-1 (out, see INV.Main.SCH[1D]), J1-2 (out, see INV.Main.SCH[1D]), J1-3 (out, see INV.Main.SCH[1D]), J1-3 (out, see INV.Main.SCH[3A]), J1-4 (out, see INV.Main.SCH[1D]), J1-4 (out, see INV.Main.SCH[3A]), J1-6 (out, see INV.Main.SCH[1D]), J1-6 (out, see INV.Main.SCH[3C]), J1-7 (in, see INV.Main.SCH[1D]), J1-7 (out, see INV.Main.SCH[4B]), J1-8 (in, see INV.Main.SCH[1D]), J1-8 (out, see INV.Main.SCH[4B]), J1-9 (out, see INV.Main.SCH[1D]), J1-9 (out, see INV.Main.SCH[3A]), J1-10 (out, see INV.Main.SCH[1D]), J1-10 (out, see INV.Main.SCH[3A]), J1-11 (out, see INV.Main.SCH[1D]), J1-11 (out, see INV.Main.SCH[3A]), J1-12 (out, see INV.Main.SCH[1D]), J1-12 (out, see INV.Main.SCH[3A]), J1-13 (out, see INV.Main.SCH[1D]), J1-13 (out, see INV.Main.SCH[2B]), J1-14 (out, see INV.Main.SCH[1D]), J1-14 (out, see INV.Main.SCH[2B]), J1-15 (out, see INV.Main.SCH[1D]), J1-15 (out, see INV.Main.SCH[2B]), J1-16 (out, see INV.Main.SCH[1D]), J1-16 (out, see INV.Main.SCH[2B]), J1-19 (out, see INV.Main.SCH[1D]), J1-19 (out, see INV.Main.SCH[2A]), J1-20 (out, see INV.Main.SCH[1D]), J1-20 (out, see INV.Main.SCH[2B]), J1-21 (out, see INV.Main.SCH[1D]), J1-22 (out, see INV.Main.SCH[1D]), J1-23 (out, see INV.Main.SCH[1D]), J1-24 (out, see INV.Main.SCH[1D]), J1-25 (out, see INV.Main.SCH[1D]), J1-25 (out, see INV.Main.SCH[2C]), J1-26 (out, see INV.Main.SCH[1D]), J1-27 (out, see INV.Main.SCH[1D]), J1-27 (out, see INV.Main.SCH[4B]), J1-28 (out, see INV.Main.SCH[1D]), J1-28 (out, see INV.Main.SCH[4C]), J1-29 (out, see INV.Main.SCH[1D]), J1-30 (out, see INV.Main.SCH[1D]), J1-31 (out, see INV.Main.SCH[1D]), J1-32 (out, see INV.Main.SCH[1D]), J1-33 (out, see INV.Main.SCH[1D]), J1-33 (out, see INV.Main.SCH[4A]), J1-34 (out, see INV.Main.SCH[1D]), J1-34 (out, see INV.Main.SCH[3D]), J1-36 (out, see INV.Main.SCH[1D]), J1-36 (out, see INV.Main.SCH[4A]), J1-39 (out, see INV.Main.SCH[1D]), J1-40 (out, see INV.Main.SCH[1D]), J1-40 (out, see INV.Main.SCH[2C]), J1-41 (out, see INV.Main.SCH[1D]), J1-42 (out, see INV.Main.SCH[1D]), J1-43 (out, see INV.Main.SCH[1D]), J1-44 (out, see INV.Main.SCH[1D]), J1-49 (out, see INV.Main.SCH[1D]), J1-50 (out, see INV.Main.SCH[1D]), J1_17 (in, see INV.Main.SCH[1D]), J1_17 (out, see INV.Main.SCH[2D]), J1_18 (in, see INV.Main.SCH[1D]), J1_18 (out, see INV.Main.SCH[2D]), J2-1 (out, see INV.Main.SCH[1D]), J2-2 (out, see INV.Main.SCH[1D]), J2-3 (out, see INV.Main.SCH[1D]), J2-4 (out, see INV.Main.SCH[1D]), J2-13 (out, see INV.Main.SCH[1D]), J2-14 (out, see INV.Main.SCH[1D]), J2-15 (out, see INV.Main.SCH[1D]), J2-16 (out, see INV.Main.SCH[1D]), J2-17 (out, see INV.Main.SCH[1D]), J2-18 (out, see INV.Main.SCH[1D]), PE *1 (see INV.Main.SCH[4B]), PE *1 (see INV.Main.SCH[4C]), PE *2 (see INV.Main.SCH[2C]), PE *2 (see INV.Main.SCH[3B]), PWM_BOOST_A (in, see INV.Main.SCH[1D]), PWM_BOOST_A (out, see INV.Main.SCH[2B]), PWM_BOOST_B (in, see INV.Main.SCH[1D]), PWM_BOOST_B (out, see INV.Main.SCH[3B]), PWM_DAB_A (in, see INV.Main.SCH[1B], INV.Main.SCH[1D]), PWM_DAB_A (out, see INV.Main.SCH[1B]), PWM_DAB_B (in, see INV.Main.SCH[1B], INV.Main.SCH[1D]), PWM_DAB_B (out, see INV.Main.SCH[1B]), PWM_DAB_C (in, see INV.Main.SCH[1D], INV.Main.SCH[2B]), PWM_DAB_C (out, see INV.Main.SCH[2B]), PWM_DAB_D (in, see INV.Main.SCH[1D], INV.Main.SCH[2B]), PWM_DAB_D (out, see INV.Main.SCH[2B]), PWM_HERIC_A (in, see INV.Main.SCH[1D]), PWM_HERIC_A (out, see INV.Main.SCH[4B]), PWM_HERIC_B (in, see INV.Main.SCH[1D]), PWM_HERIC_B (out, see INV.Main.SCH[4B]), PWM_MPPT (in, see INV.Main.SCH[1D]), PWM_MPPT (out, see INV.Main.SCH[4D]), PWM_Sine_A (in, see INV.Main.SCH[1D], INV.Main.SCH[3B]), PWM_Sine_A (out, see INV.Main.SCH[3B]), PWM_Sine_B (in, see INV.Main.SCH[1D], INV.Main.SCH[3B]), PWM_Sine_B (out, see INV.Main.SCH[3B])

## Nets
-5V_DR1: C31.1 C52.2 C55.1 C64.2 C145.2 C146.2 C151.1 C152.1 C153.1 R173.2 T2.16 U4.4(VEE) U10.4(VEE)
-5V_DR2: C30.1 C50.2 C78.2 C103.1 C116.2 C117.2 C122.1 C123.1 C124.1 R167.2 T2.22 U3.4(VEE) U16.4(VEE)
-5V_DR3: C42.2 C62.1 C79.1 C80.1 C104.2 C105.2 C125.2 C126.2 C135.1 C136.1 C137.1 C154.1 C184.2 R168.2 T2.19 U9.4(VEE) U14.4(VEE) U15.4(VEE) U22.4(VEE)
-5V_DR4: C43.1 C44.1 C158.2 C159.2 C166.1 C167.1 C168.1 R189.2 T2.13 U11.4(VEE)
G_DR1: C33.1 C45.1 C52.1 C55.2 C57.2 C63.2 C147.2 C148.2 C149.2 C150.2 C151.2 C152.2 C153.2 DZ3.1(A) L2.1 R26.2 R58.2 R88.2 R173.1 V3.3(E) V5.3(E) V8.2(C)
G_DR2: C32.1 C41.1 C50.1 C91.2 C99.2 C103.2 C118.2 C119.2 C120.2 C121.2 C122.2 C123.2 C124.2 DZ1.1(A) L2.2 R55.2 R132.1 R166.2 R167.1 V2.3(E) V6.3(E) V7.2(C)
G_DR4: C35.2 C43.2 C54.1 C160.2 C161.2 C162.2 C163.2 C166.2 C167.2 C168.2 DZ4.1(A) L1.2 R37.1 R189.1 V1.3(E) V4.2(C)
G_LLC_A: C12.1 C13.1 C39.1 C49.1 C53.2 C58.1 C209.2 C210.2 C211.2 C212.2 C213.2 C214.2 C215.2 DZ7.1(A) QH1.3(E) QH3.2(C) R71.2 R214.1 T1.3
G_LLC_B: C20.1 C21.1 C48.1 C56.1 C59.2 C60.1 C65.2 C66.2 C67.2 C68.2 C199.2 C200.2 C201.2 C202.2 C204.2 C205.2 C206.2 DZ6.1(A) QH2.3(E) QH4.2(C) R84.2 R213.1
G_NEG: C1.1 C2.1 C3.1 C4.2 C5.1 C6.1 C14.2 C155.2 C156.1 C165.1 CE1.2 CE2.2 FB2.2 J2.35 J2.37 J2.38 J2.45 J2.46 J3.14 NTC1.1 NTC2.1 R187.2 U1.13(Gnd) U8.13(Gnd) U21.3
GND: FB2.1 J3.19 J4.5 J4.6 J4.11 J4.12 J4.19 J4.20 J4.29 J4.30 R65.2 R68.1 R72.1 R74.2 R76.2 R78.2 R80.1 R93.2 R99.1 R144.2 R145.2 R146.2 R149.1 R150.1 R157.2 R158.2 R201.2
GND_BAT: BT1.5 C70.1 C71.1 C72.1 C73.1 C74.1 C75.1 C76.1 C77.1 C96.1 C97.1 C138.2 C139.2 C140.1 C141.1 C142.2 C164.2 C174.1 C175.1 C176.1 C177.1 C178.1 C179.1 C180.1 C181.1 C182.1 C183.1 C195.2 C196.2 L6.3 P1.3 P1.4 Q13.2(C) Q14.2(C) QL3.3(S) QL4.3(S) R153.2 R154.2 R186.1 R204.2 R206.2 R212.2 T3.5 U12.4(VEE) U13.4(VEE) U19.2(InA-) U19.3(InA+) U19.6(InB-) U19.7(OutPutB) U20.3(+INA) U20.4(GND)
LLC_A_-5V: C9.1 C10.1 C11.1 C49.2 C58.2 C207.2 C208.2 C213.1 C214.1 C215.1 Q5.3(C) R214.2 T2.1 U2.4(VEE)
LLC_B_-5V: C17.1 C18.1 C19.1 C56.2 C60.2 C197.2 C198.2 C204.1 C205.1 C206.1 Q8.3(C) R213.2 T2.7 U7.4(VEE)
LLC_CD_-5V: C81.1 C82.1 C83.1 C86.1 C87.1 C88.1 C108.2 C109.2 C112.2 C113.2 C185.2 C186.2 C192.1 C193.1 C194.1 Q15.3(C) Q16.3(C) R205.2 T2.10 U17.4(VEE) U18.4(VEE)
NEG: C7.2 C15.2 C16.2 C51.2 C61.2 C62.2 C84.1 C85.1 C89.1 C90.1 C92.1 C93.1 C98.1 C100.1 C104.1 C105.1 C106.1 C107.1 C108.1 C109.1 C110.2 C111.2 C112.1 C113.1 C115.1 C127.2 C128.2 C129.2 C130.2 C135.2 C136.2 C137.2 C143.2 C144.2 C157.1 C170.1 C171.1 C184.1 C187.2 C188.2 C189.2 C190.2 C192.2 C193.2 C194.2 C203.1 DZ2.1(A) DZ5.1(A) LED1.2 NEG.1 QH3.3(E) QH4.3(E) R13.1 R20.2 R32.2 R87.2 R136.2 R138.1 R160.2 R162.2 R168.1 R188.2 R197.2 R200.2 R205.1 V4.3(E) V7.3(E) V8.3(E) V9.3(E) V10.3(E)
VS1: C26.1 C27.1 C28.1 C29.1 C47.1 C131.1 C132.2 Q7.2(C) QL2.3(S) QL3.2(D) R81.2 T1.1 T3.7 U6.4(VEE)
VS2: BT1.7 C22.1 C23.1 C24.1 C25.1 C46.1 C133.2 C134.1 Q6.2(C) QL1.3(S) QL4.2(D) R79.2 T1.2 U5.4(VEE)
+5V: C2.2 C3.2 C6.2 C156.2 CE1.1 CE2.1 FB1.1 J3.15 J3.16 R176.1 R178.2 U1.14(Vcc) U8.14(Vcc) ; port +5V
+5VF: FB1.2 J2.47 J2.48 ; port +5VF
+15V_DAB_A: C26.2 C27.2 C28.2 C29.2 C131.2 C132.1 D6.2(K) R35.1 R36.1 U6.6(VCC) ; off-sheet +15V_DAB_A
+15V_DAB_B: C22.2 C23.2 C24.2 C25.2 C133.1 C134.2 D7.2(K) R33.1 R34.1 U5.6(VCC) ; off-sheet +15V_DAB_B
+15V_DAB_C: C70.2 C71.2 C72.2 C73.2 C138.1 C139.1 C140.2 D9.1(A1) D10.2(K) R107.1 R108.1 R175.2 U12.6(VCC) U20.8(V+) ; off-sheet +15V_DAB_C
+15V_DAB_D: C74.2 C75.2 C76.2 C77.2 C141.2 C142.1 D11.2(K) R109.1 R110.1 U13.6(VCC) ; off-sheet +15V_DAB_D
+15V_DR1: C31.2 C33.2 C63.1 C64.1 C145.1 C146.1 C147.1 C148.1 C149.1 C150.1 D12.2(K) DZ3.2(K) U4.6(VCC) U10.6(VCC) ; off-sheet +15V_DR1
+15V_DR2: C30.2 C32.2 C78.1 C91.1 C116.1 C117.1 C118.1 C119.1 C120.1 C121.1 D3.2(K) DZ1.2(K) U3.6(VCC) U16.6(VCC) ; off-sheet +15V_DR2
+15V_DR3: C42.1 C51.1 C79.2 C80.2 C92.2 C93.2 C125.1 C126.1 C127.1 C128.1 C129.1 C130.1 C154.2 C157.2 D5.2(K) DZ2.2(K) U9.6(VCC) U14.6(VCC) U15.6(VCC) U22.6(VCC) ; off-sheet +15V_DR3
+15V_DR4: C44.2 C54.2 C158.1 C159.1 C160.1 C161.1 C162.1 C163.1 D13.2(K) DZ4.2(K) U11.6(VCC) ; off-sheet +15V_DR4
+15V_LLC_A: C9.2 C10.2 C11.2 C12.2 C13.2 C207.1 C208.1 C209.1 C210.1 C211.1 C212.1 D17.2(K) DZ7.2(K) R21.1 R22.1 U2.6(VCC) ; off-sheet +15V_LLC_A
+15V_LLC_B: C17.2 C18.2 C19.2 C20.2 C21.2 C197.1 C198.1 C199.1 C200.1 C201.1 C202.1 D16.2(K) DZ6.2(K) R27.1 R28.1 U7.6(VCC) ; off-sheet +15V_LLC_B
+15V_LLC_CD: C81.2 C82.2 C83.2 C84.2 C85.2 C86.2 C87.2 C88.2 C89.2 C90.2 C185.1 C186.1 C187.1 C188.1 C189.1 C190.1 D15.2(K) DZ5.2(K) R111.1 R112.1 R113.1 R114.1 U17.6(VCC) U18.6(VCC) ; off-sheet +15V_LLC_CD
BAT +48: C174.2 C175.2 C176.2 C177.2 C178.2 C179.2 C180.2 C181.2 C182.2 C183.2 L6.4 P1.1 P1.2 QL1.2(D) QL2.2(D) R170.2 R182.1 R190.2 R204.1 ; off-sheet BAT +48
BUS +: BUS+.1 C8.2 C15.1 C16.1 C143.1 C144.1 D8.3(K) R7.1 R171.1 V1.2(C) V2.2(C) V3.2(C) ; off-sheet BUS +
J1-1: J2.1 J3.1 ; port J1-1
J1-2: J2.2 J3.2 ; port J1-2
J1-3: J2.3 R10.2 ; port J1-3
J1-4: J2.4 R16.2 ; port J1-4
J1-6: C155.1 J2.6 R176.2 U21.4 ; port J1-6
J1-7: J2.8 R94.1 ; port J1-7
J1-8: J2.7 R103.1 ; port J1-8
J1-10: J2.9 J2.10 R1.2 ; port J1-9, port J1-10
J1-11: J2.11 J2.12 R2.2 ; port J1-11, port J1-12
J1-13: J2.13 J2.15 L3.3 R98.1 R102.1 ; port J1-13, port J1-15
J1-14: J2.14 J2.16 L3.4 R98.2 R102.2 ; port J1-14, port J1-16
J1-19: J2.19 R3.1 ; port J1-19
J1-20: J2.20 R29.1 ; port J1-20
J1-21: J2.21 J3.4 ; port J1-21
J1-22: J2.22 J3.3 ; port J1-22
J1-23: J2.23 J3.10 ; port J1-23
J1-24: J2.24 J3.9 ; port J1-24
J1-25: J2.25 NTC1.2 ; port J1-25
J1-26: J2.26 J3.11 ; port J1-26
J1-27: J2.27 R23.1 ; port J1-27
J1-28: J2.28 R163.1 ; port J1-28
J1-29: J2.29 J3.6 ; port J1-29
J1-30: J2.30 J3.5 ; port J1-30
J1-31: J2.31 J3.7 ; port J1-31
J1-32: J2.32 J3.8 ; port J1-32
J1-33: J2.33 R11.2 ; port J1-33
J1-34: C165.2 J2.34 R178.1 R187.1 ; port J1-34
J1-36: J2.36 R12.2 ; port J1-36
J1-39: J2.39 J3.12 ; port J1-39
J1-40: J2.40 NTC2.2 ; port J1-40
J1-41: J2.41 J3.22 ; port J1-41
J1-42: J2.42 J3.24 ; port J1-42
J1-43: J2.43 J2.44 J3.13 ; port J1-43, port J1-44
J1-49: J2.49 J2.50 J3.17 ; port J1-49, port J1-50
J1_17: J2.17 R195.1 ; port J1_17
J1_18: J2.18 R211.1 ; port J1_18
J2-1: J3.21 J4.1 ; port J2-1
J2-2: J3.28 J4.2 ; port J2-2
J2-3: J3.20 J4.3 ; port J2-3
J2-4: J3.18 J4.4 ; port J2-4
J2-13: J3.25 J4.13 ; port J2-13
J2-14: J3.23 J4.14 ; port J2-14
J2-15: J3.27 J4.15 ; port J2-15
J2-16: J3.26 J4.16 ; port J2-16
J2-17: J3.30 J4.17 ; port J2-17
J2-18: J3.29 J4.18 ; port J2-18
PE *1: C34.1 C114.1 PE3.1 ; port PE *1
PE *2: C8.1 C115.2 PE4.1 ; port PE *2
PWM_BOOST_A: J4.9 R77.1 ; port PWM_BOOST_A
PWM_BOOST_B: J4.10 R101.2 ; port PWM_BOOST_B
PWM_DAB_A: J4.22 R48.2 R119.2 ; port PWM_DAB_A
PWM_DAB_B: J4.21 R45.2 R117.2 ; port PWM_DAB_B
PWM_DAB_C: J4.24 R38.1 R131.1 ; port PWM_DAB_C
PWM_DAB_D: J4.23 R43.1 R130.1 ; port PWM_DAB_D
PWM_HERIC_A: J4.27 R122.1 ; port PWM_HERIC_A
PWM_HERIC_B: J4.26 R92.1 ; port PWM_HERIC_B
PWM_MPPT: J4.8 R183.1 ; port PWM_MPPT
PWM_Sine_A: J4.25 R39.2 R116.2 ; port PWM_Sine_A
PWM_Sine_B: J4.28 R41.2 R115.2 ; port PWM_Sine_B
NetAC_L_1: AC_L.1 C34.2 C69.2 R97.2 U8.2(Out)
NetAC_N_1: AC_N.1 C69.1 C114.2 L2.4 R106.2
NetBAT+_1: BAT+.1 C169.2 C172.2 C173.2 L6.1
NetBAT-_1: BAT-.1 C172.1 C173.1 C191.1 L6.2
NetBT1_1: BT1.1 D4.2(K)
NetBT1_4: BT1.4 J1.1 T2.4 T3.4
NetBT1_6: BT1.6 D11.1(A)
NetBT1_8: BT1.8 D7.1(A)
NetC1_2: C1.2 R2.1 U1.12(Vout)
NetC4_1: C4.1 R1.1 U1.11(Vfef)
NetC5_2: C5.2 R12.1 U8.12(Vout)
NetC7_1: C7.1 QH1.2(C) QH2.2(C) R6.2 R17.1 U1.1(In)
NetC14_1: C14.1 R11.1 U8.11(Vfef)
NetC35_1: C35.1 R51.1
NetC36_1: C36.1 R47.2 R65.1 U2.3(CATHODE)
NetC36_2: C36.2 R38.2 R47.1 U2.1(ANODE)
NetC37_1: C37.1 R59.2 R74.1 U5.3(CATHODE)
NetC37_2: C37.2 R45.1 R59.1 U5.1(ANODE)
NetC38_1: C38.1 R60.2 R76.1 U6.3(CATHODE)
NetC38_2: C38.2 R48.1 R60.1 U6.1(ANODE)
NetC39_2: C39.2 Q1.1(B) Q5.1(B) R40.2
NetC40_1: C40.1 R63.2 R78.1 U7.3(CATHODE)
NetC40_2: C40.2 R43.2 R63.1 U7.1(ANODE)
NetC41_2: C41.2 R54.2
NetC45_2: C45.2 R57.2
NetC46_2: C46.2 Q2.1(B) Q6.1(B) R46.1
NetC47_2: C47.2 Q3.1(B) Q7.1(B) R49.1
NetC48_2: C48.2 Q4.1(B) Q8.1(B) R52.2
NetC53_1: C53.1 R70.2
NetC57_1: C57.1 R89.1
NetC59_1: C59.1 R83.2
NetC61_1: C61.1 R86.1
NetC65_1: C65.1 C66.1 C67.1 C68.1 T1.4
NetC94_1: C94.1 R125.2 R144.1 U12.3(CATHODE)
NetC94_2: C94.2 R117.1 R125.1 U12.1(ANODE)
NetC95_1: C95.1 R126.2 R145.1 U13.3(CATHODE)
NetC95_2: C95.2 R119.1 R126.1 U13.1(ANODE)
NetC96_2: C96.2 Q10.1(B) Q14.1(B) R120.1
NetC97_2: C97.2 Q9.1(B) Q13.1(B) R118.1
NetC98_2: C98.2 R137.2
NetC99_1: C99.1 R133.2
NetC100_2: C100.2 R139.1
NetC101_1: C101.1 R147.2 R157.1 U17.3(CATHODE)
NetC101_2: C101.2 R130.2 R147.1 U17.1(ANODE)
NetC102_1: C102.1 R148.2 R158.1 U18.3(CATHODE)
NetC102_2: C102.2 R131.2 R148.1 U18.1(ANODE)
NetC106_2: C106.2 Q11.1(B) Q15.1(B) R140.2
NetC107_2: C107.2 Q12.1(B) Q16.1(B) R141.2
NetC110_1: C110.1 R159.2
NetC111_1: C111.1 R161.2
NetC164_1: C164.1 R179.1 R180.2 R186.2
NetC169_1: C169.1 C191.2 PE2.1
NetC170_2: C170.2 R196.1
NetC171_2: C171.2 R199.2
NetC195_1: C195.1 C196.1 PE1.1
NetC203_2: C203.2 R212.1
NetD1_1: D1.1(A) D2.1(A1) D2.3(A2) D4.1(A) J1.2
NetD1_2: D1.2(K) T3.1
NetD2_2: D2.2(K) T2.5
NetD3_1: D3.1(A) T2.21
NetD5_1: D5.1(A) T2.18
NetD6_1: D6.1(A) T3.8
NetD8_1: D8.1(A1) D8.2(A2) L5.2 V9.2(C) V10.2(C)
NetD9_2: D9.2(A2) R170.1
NetD9_3: D9.3(K) R169.1
NetD10_1: D10.1(A) T3.6
NetD12_1: D12.1(A) T2.15
NetD13_1: D13.1(A) T2.12
NetD14_1: D14.1(A1) D14.2(A2) R203.1
NetD14_3: D14.3(K) U20.7(OUTB) U21.2
NetD15_1: D15.1(A) T2.11
NetD16_1: D16.1(A) T2.8
NetD17_1: D17.1(A) T2.2
NetL1_1: L1.1 U1.2(Out)
NetL2_3: L2.3 U8.1(In)
NetL5_1: L5.1 L5_PV.1
NetLED1_1: LED1.1 R177.2 R188.1
NetQ1_2: Q1.2(E) Q5.2(E) R50.1 R62.1
NetQ1_3: Q1.3(C) R21.2 R22.2
NetQ2_2: Q2.2(C) R33.2 R34.2
NetQ2_3: Q2.3(E) Q6.3(E) R61.2 R69.2
NetQ3_2: Q3.2(C) R35.2 R36.2
NetQ3_3: Q3.3(E) Q7.3(E) R64.2 R73.2
NetQ4_2: Q4.2(E) Q8.2(E) R66.1 R75.1
NetQ4_3: Q4.3(C) R27.2 R28.2
NetQ9_2: Q9.2(C) R107.2 R108.2
NetQ9_3: Q9.3(E) Q13.3(E) R127.2 R142.2
NetQ10_2: Q10.2(C) R109.2 R110.2
NetQ10_3: Q10.3(E) Q14.3(E) R129.2 R143.2
NetQ11_2: Q11.2(E) Q15.2(E) R151.1 R155.1
NetQ11_3: Q11.3(C) R111.2 R112.2
NetQ12_2: Q12.2(E) Q16.2(E) R152.1 R156.1
NetQ12_3: Q12.3(C) R113.2 R114.2
NetQH1_1: QH1.1(G) R50.2 R62.2 R70.1 R71.1
NetQH2_1: QH2.1(G) R66.2 R75.2 R83.1 R84.1
NetQH3_1: QH3.1(G) R151.2 R155.2 R159.1 R160.1
NetQH4_1: QH4.1(G) R152.2 R156.2 R161.1 R162.1
NetQL1_1: QL1.1(G) R61.1 R69.1 R79.1
NetQL2_1: QL2.1(G) R64.1 R73.1 R81.1
NetQL3_1: QL3.1(G) R127.1 R142.1 R153.1
NetQL4_1: QL4.1(G) R129.1 R143.1 R154.1
NetR3_2: R3.2 R4.1
NetR4_2: R4.2 R5.1
NetR5_2: R5.2 R6.1
NetR7_2: R7.2 R8.1
NetR8_2: R8.2 R9.1
NetR9_2: R9.2 R10.1
NetR13_2: R13.2 R14.1
NetR14_2: R14.2 R15.1
NetR15_2: R15.2 R16.1
NetR17_2: R17.2 R18.1
NetR18_2: R18.2 R19.1
NetR19_2: R19.2 R20.1
NetR23_2: R23.2 R24.1
NetR24_2: R24.2 R25.1
NetR25_2: R25.2 R26.1
NetR29_2: R29.2 R30.1
NetR30_2: R30.2 R31.1
NetR31_2: R31.2 R32.1
NetR37_2: R37.2 R51.2 R67.2 V1.1(G)
NetR39_1: R39.1 R53.2 U3.1(ANODE)
NetR40_1: R40.1 U2.5(VOUT)
NetR41_1: R41.1 R56.2 U4.1(ANODE)
NetR42_1: R42.1 R54.1 R55.1 V2.1(G)
NetR42_2: R42.2 U3.5(VOUT)
NetR44_1: R44.1 R57.1 R58.1 V3.1(G)
NetR44_2: R44.2 U4.5(VOUT)
NetR46_2: R46.2 U5.5(VOUT)
NetR49_2: R49.2 U6.5(VOUT)
NetR52_1: R52.1 U7.5(VOUT)
NetR53_1: R53.1 R68.2 U3.3(CATHODE)
NetR56_1: R56.1 R72.2 U4.3(CATHODE)
NetR67_1: R67.1 U11.5(VOUT)
NetR77_2: R77.2 R85.1 U9.1(ANODE)
NetR80_2: R80.2 R90.1 U10.3(CATHODE)
NetR82_1: R82.1 U9.5(VOUT)
NetR82_2: R82.2 R86.2 R87.1 V4.1(G)
NetR85_2: R85.2 R93.1 U9.3(CATHODE)
NetR88_1: R88.1 R89.2 R91.2 V5.1(G)
NetR90_2: R90.2 R92.2 U10.1(ANODE)
NetR91_1: R91.1 U10.5(VOUT)
NetR94_2: R94.2 R95.1
NetR95_2: R95.2 R96.1
NetR96_2: R96.2 R97.1
NetR99_2: R99.2 R100.1 U11.3(CATHODE)
NetR100_2: R100.2 R101.1 U11.1(ANODE)
NetR103_2: R103.2 R104.1
NetR104_2: R104.2 R105.1
NetR105_2: R105.2 R106.1
NetR115_1: R115.1 R134.2 U14.1(ANODE)
NetR116_1: R116.1 R135.2 U15.1(ANODE)
NetR118_2: R118.2 U12.5(VOUT)
NetR120_2: R120.2 U13.5(VOUT)
NetR121_1: R121.1 U16.5(VOUT)
NetR121_2: R121.2 R132.2 R133.1 V6.1(G)
NetR122_2: R122.2 R128.1 U16.1(ANODE)
NetR123_1: R123.1 R137.1 R138.2 V7.1(G)
NetR123_2: R123.2 U14.5(VOUT)
NetR124_1: R124.1 R136.1 R139.2 V8.1(G)
NetR124_2: R124.2 U15.5(VOUT)
NetR128_2: R128.2 R146.1 U16.3(CATHODE)
NetR134_1: R134.1 R149.2 U14.3(CATHODE)
NetR135_1: R135.1 R150.2 U15.3(CATHODE)
NetR140_1: R140.1 U17.5(VOUT)
NetR141_1: R141.1 U18.5(VOUT)
NetR163_2: R163.2 R164.1
NetR164_2: R164.2 R165.1
NetR165_2: R165.2 R166.1
NetR169_2: R169.2 R202.2 U19.1(OutPutA) U19.8(Vcc)
NetR171_2: R171.2 R172.1
NetR172_2: R172.2 R174.1
NetR174_2: R174.2 R177.1
NetR175_1: R175.1 U21.1
NetR179_2: R179.2 U20.6(-INB)
NetR180_1: R180.1 R181.2
NetR181_1: R181.1 R182.2
NetR183_2: R183.2 R198.1 U22.1(ANODE)
NetR184_1: R184.1 R185.1 U22.5(VOUT)
NetR184_2: R184.2 R196.2 R197.1 V9.1(G)
NetR185_2: R185.2 R199.1 R200.1 V10.1(G)
NetR190_1: R190.1 R191.2
NetR191_1: R191.1 R192.2
NetR192_1: R192.1 R193.2
NetR193_1: R193.1 R194.2
NetR194_1: R194.1 R195.2
NetR198_2: R198.2 R201.1 U22.3(CATHODE)
NetR202_1: R202.1 R203.2 U20.5(+INB)
NetR206_1: R206.1 R207.2
NetR207_1: R207.1 R208.2
NetR208_1: R208.1 R209.2
NetR209_1: R209.1 R210.2
NetR210_1: R210.1 R211.2
NetU20_1: U20.1(OUTA) U20.2(-INA)
NetV5_2: V5.2(C) V6.2(C)

Not connected (* = marked no-connect by the designer): BT1 2* 3*; J2 5*; J4 7; T3 2* 3*; U19 4(VEE/Gnd) 5(InB+)

## Layout directives
mark named ?: NetR169_2, NetU19_4, NetU19_5
mark named Check: NetJ4_7

## Notes on the sheet
- Title:
- NOTE:
- Size:
- Date:
- Uplate:
- Number:
- Time:
- Revision:
- (in symbol LM358N/NOPB) A; B